# EAGLE design OPTOCAPE (EAGLE 6.6.0)
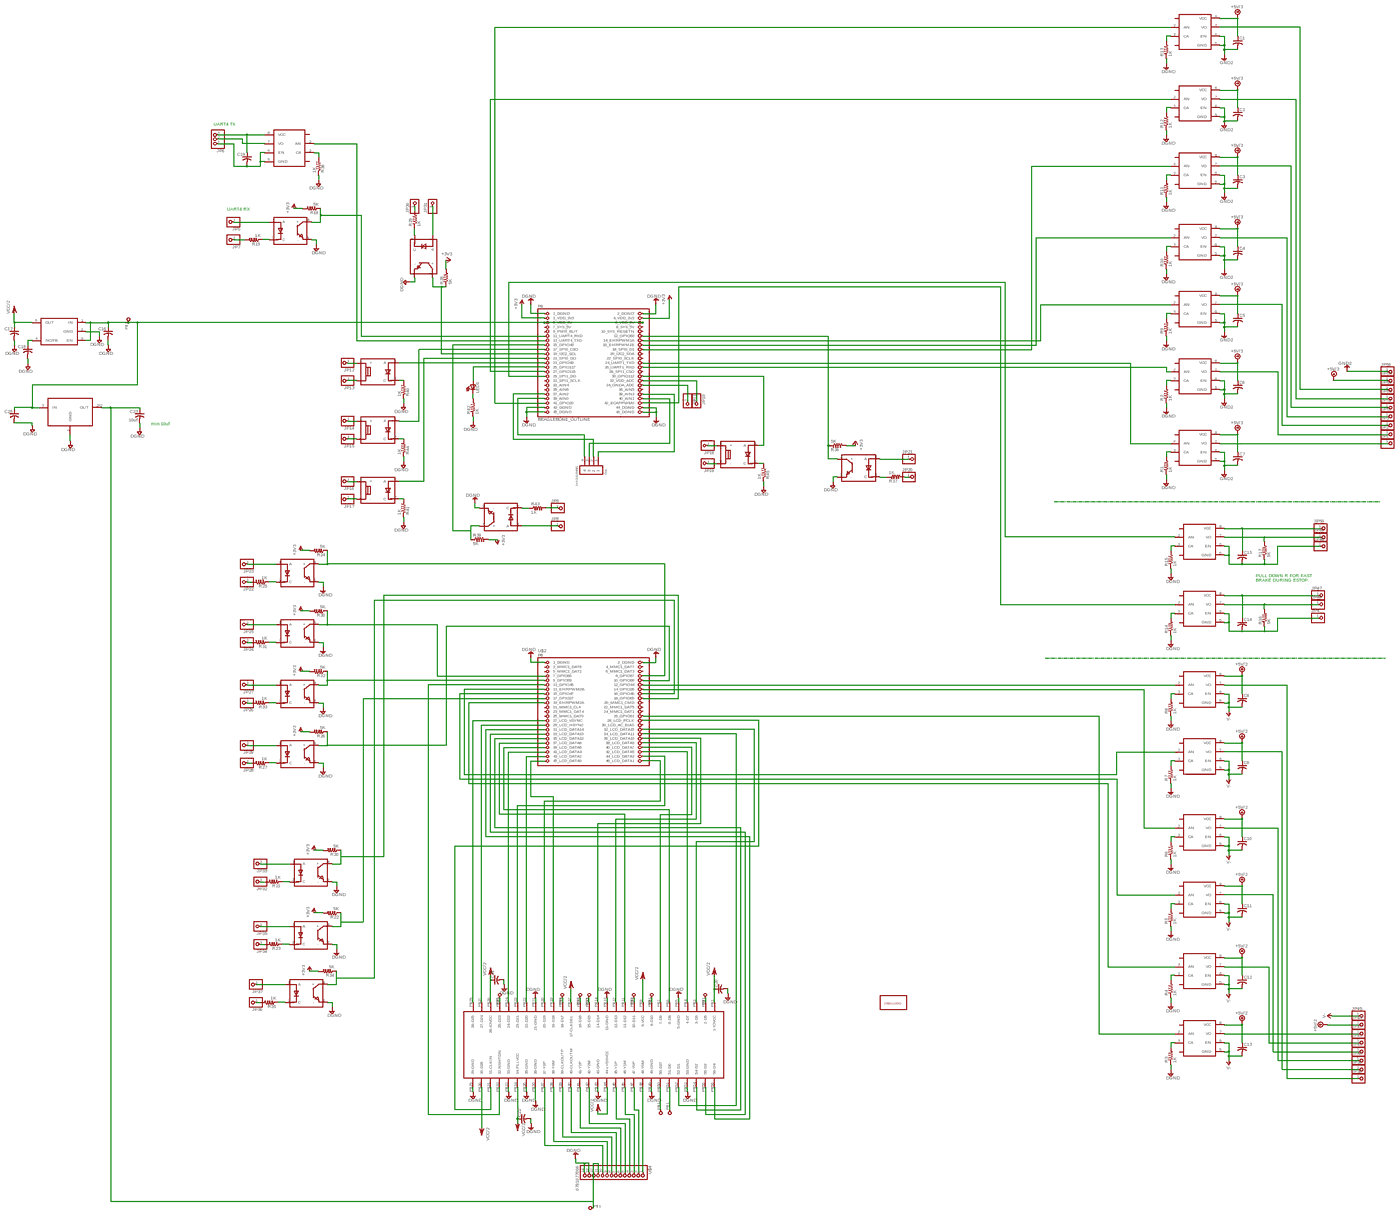
[diagram p0: schematic, sheet 1, overview]
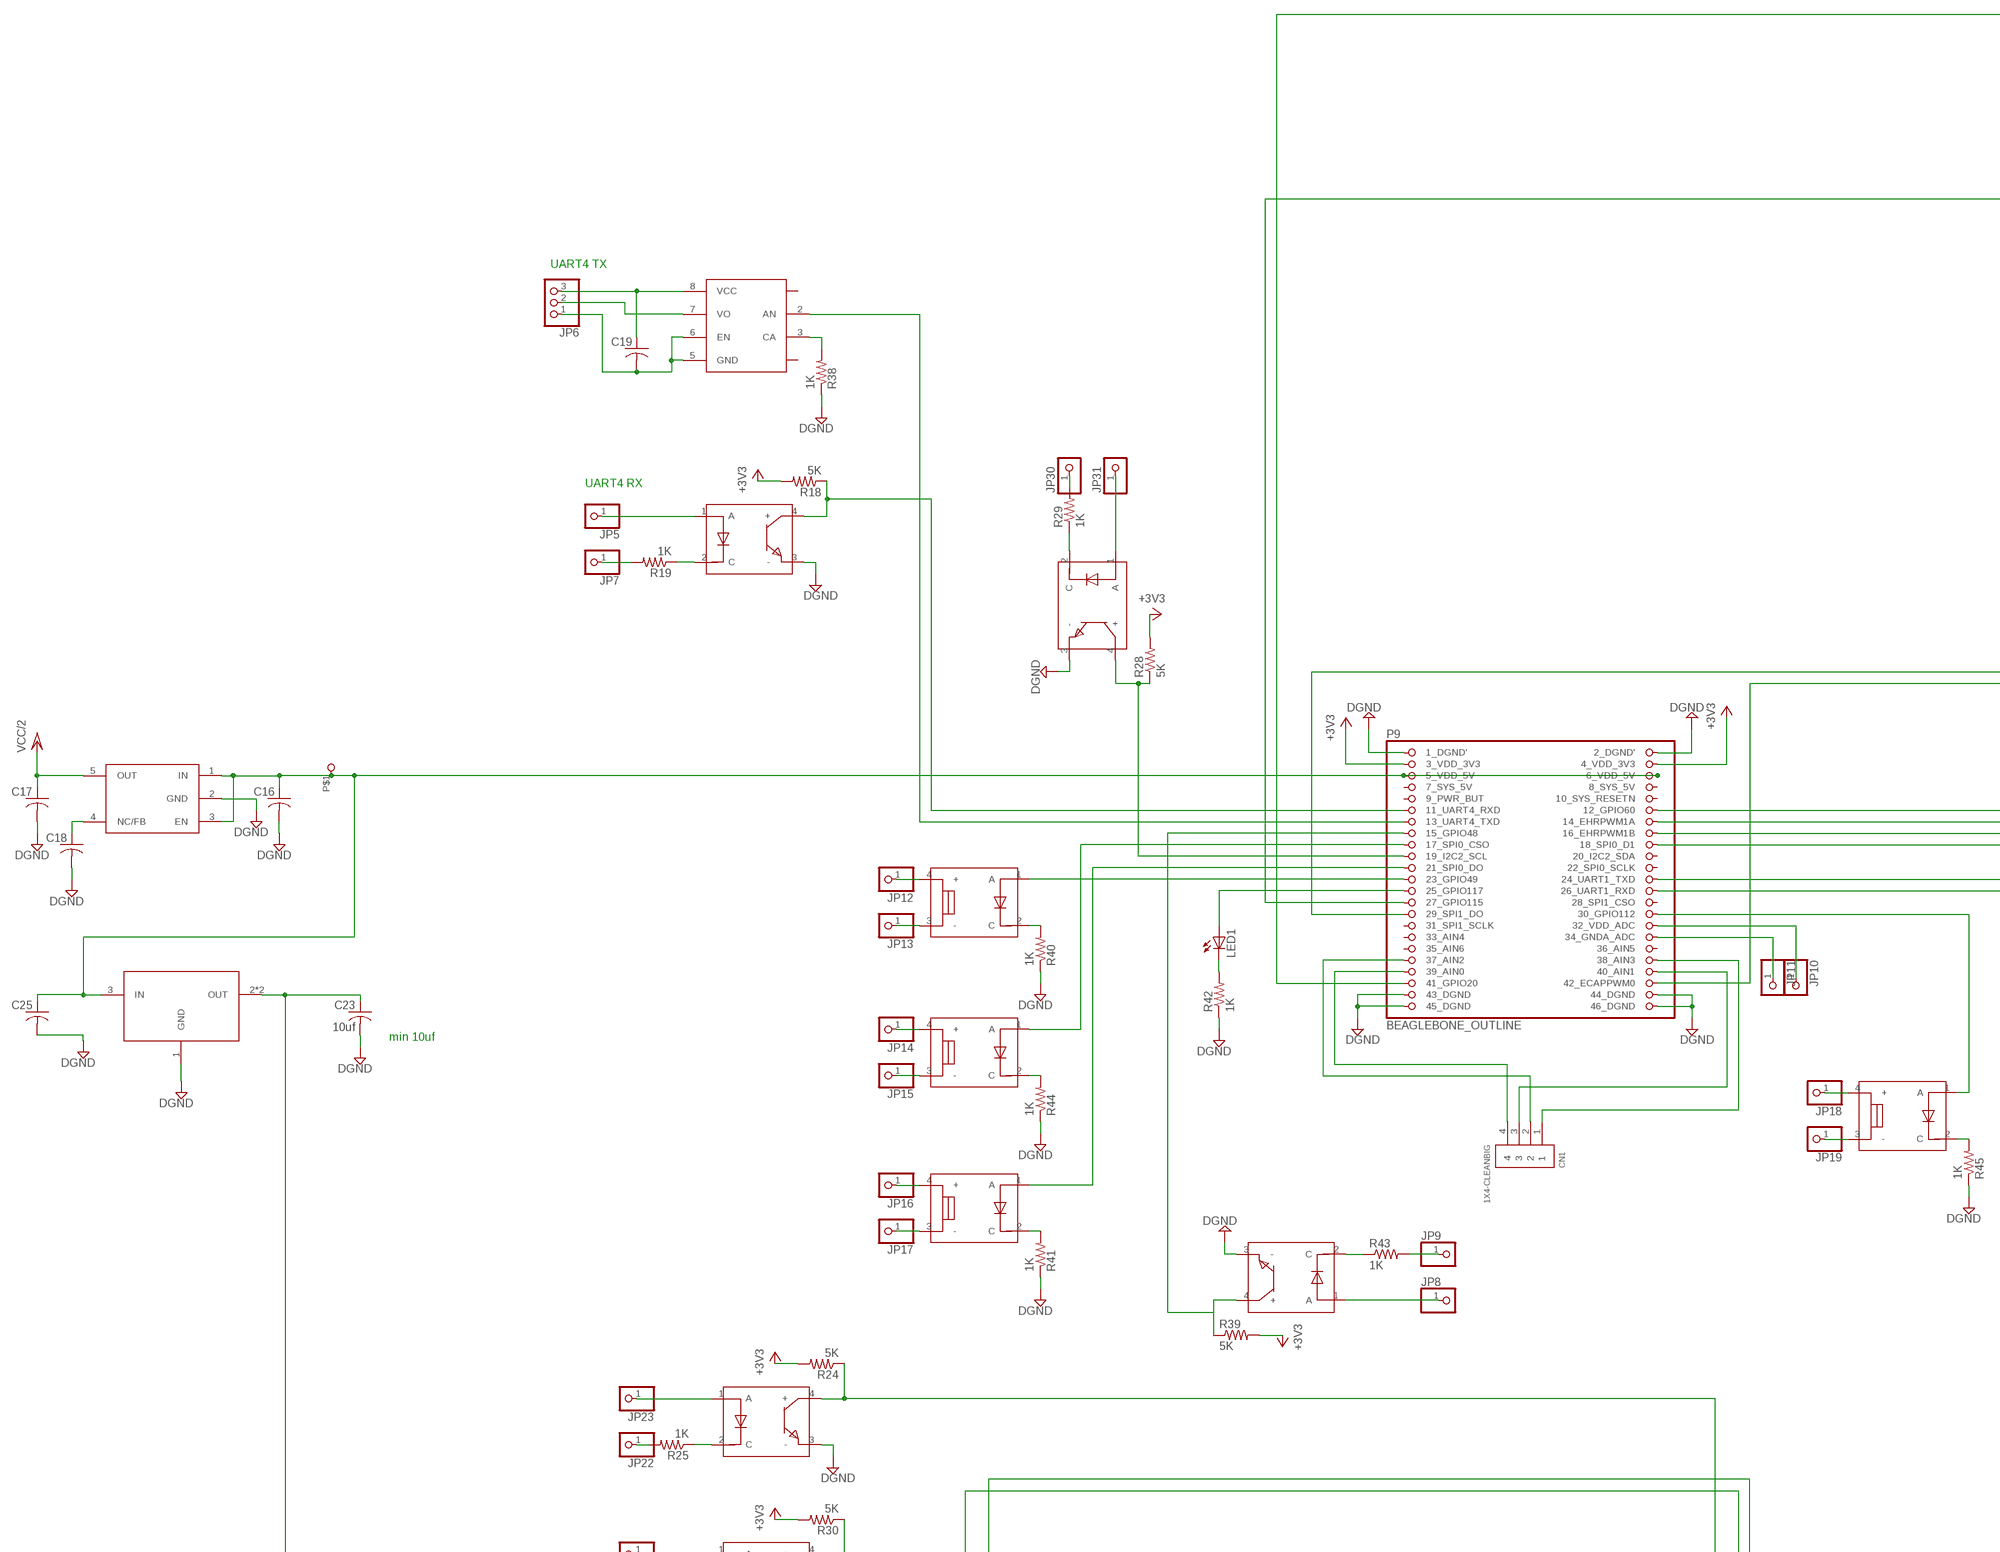
[diagram p1: schematic, sheet 1, part 1 of 4]
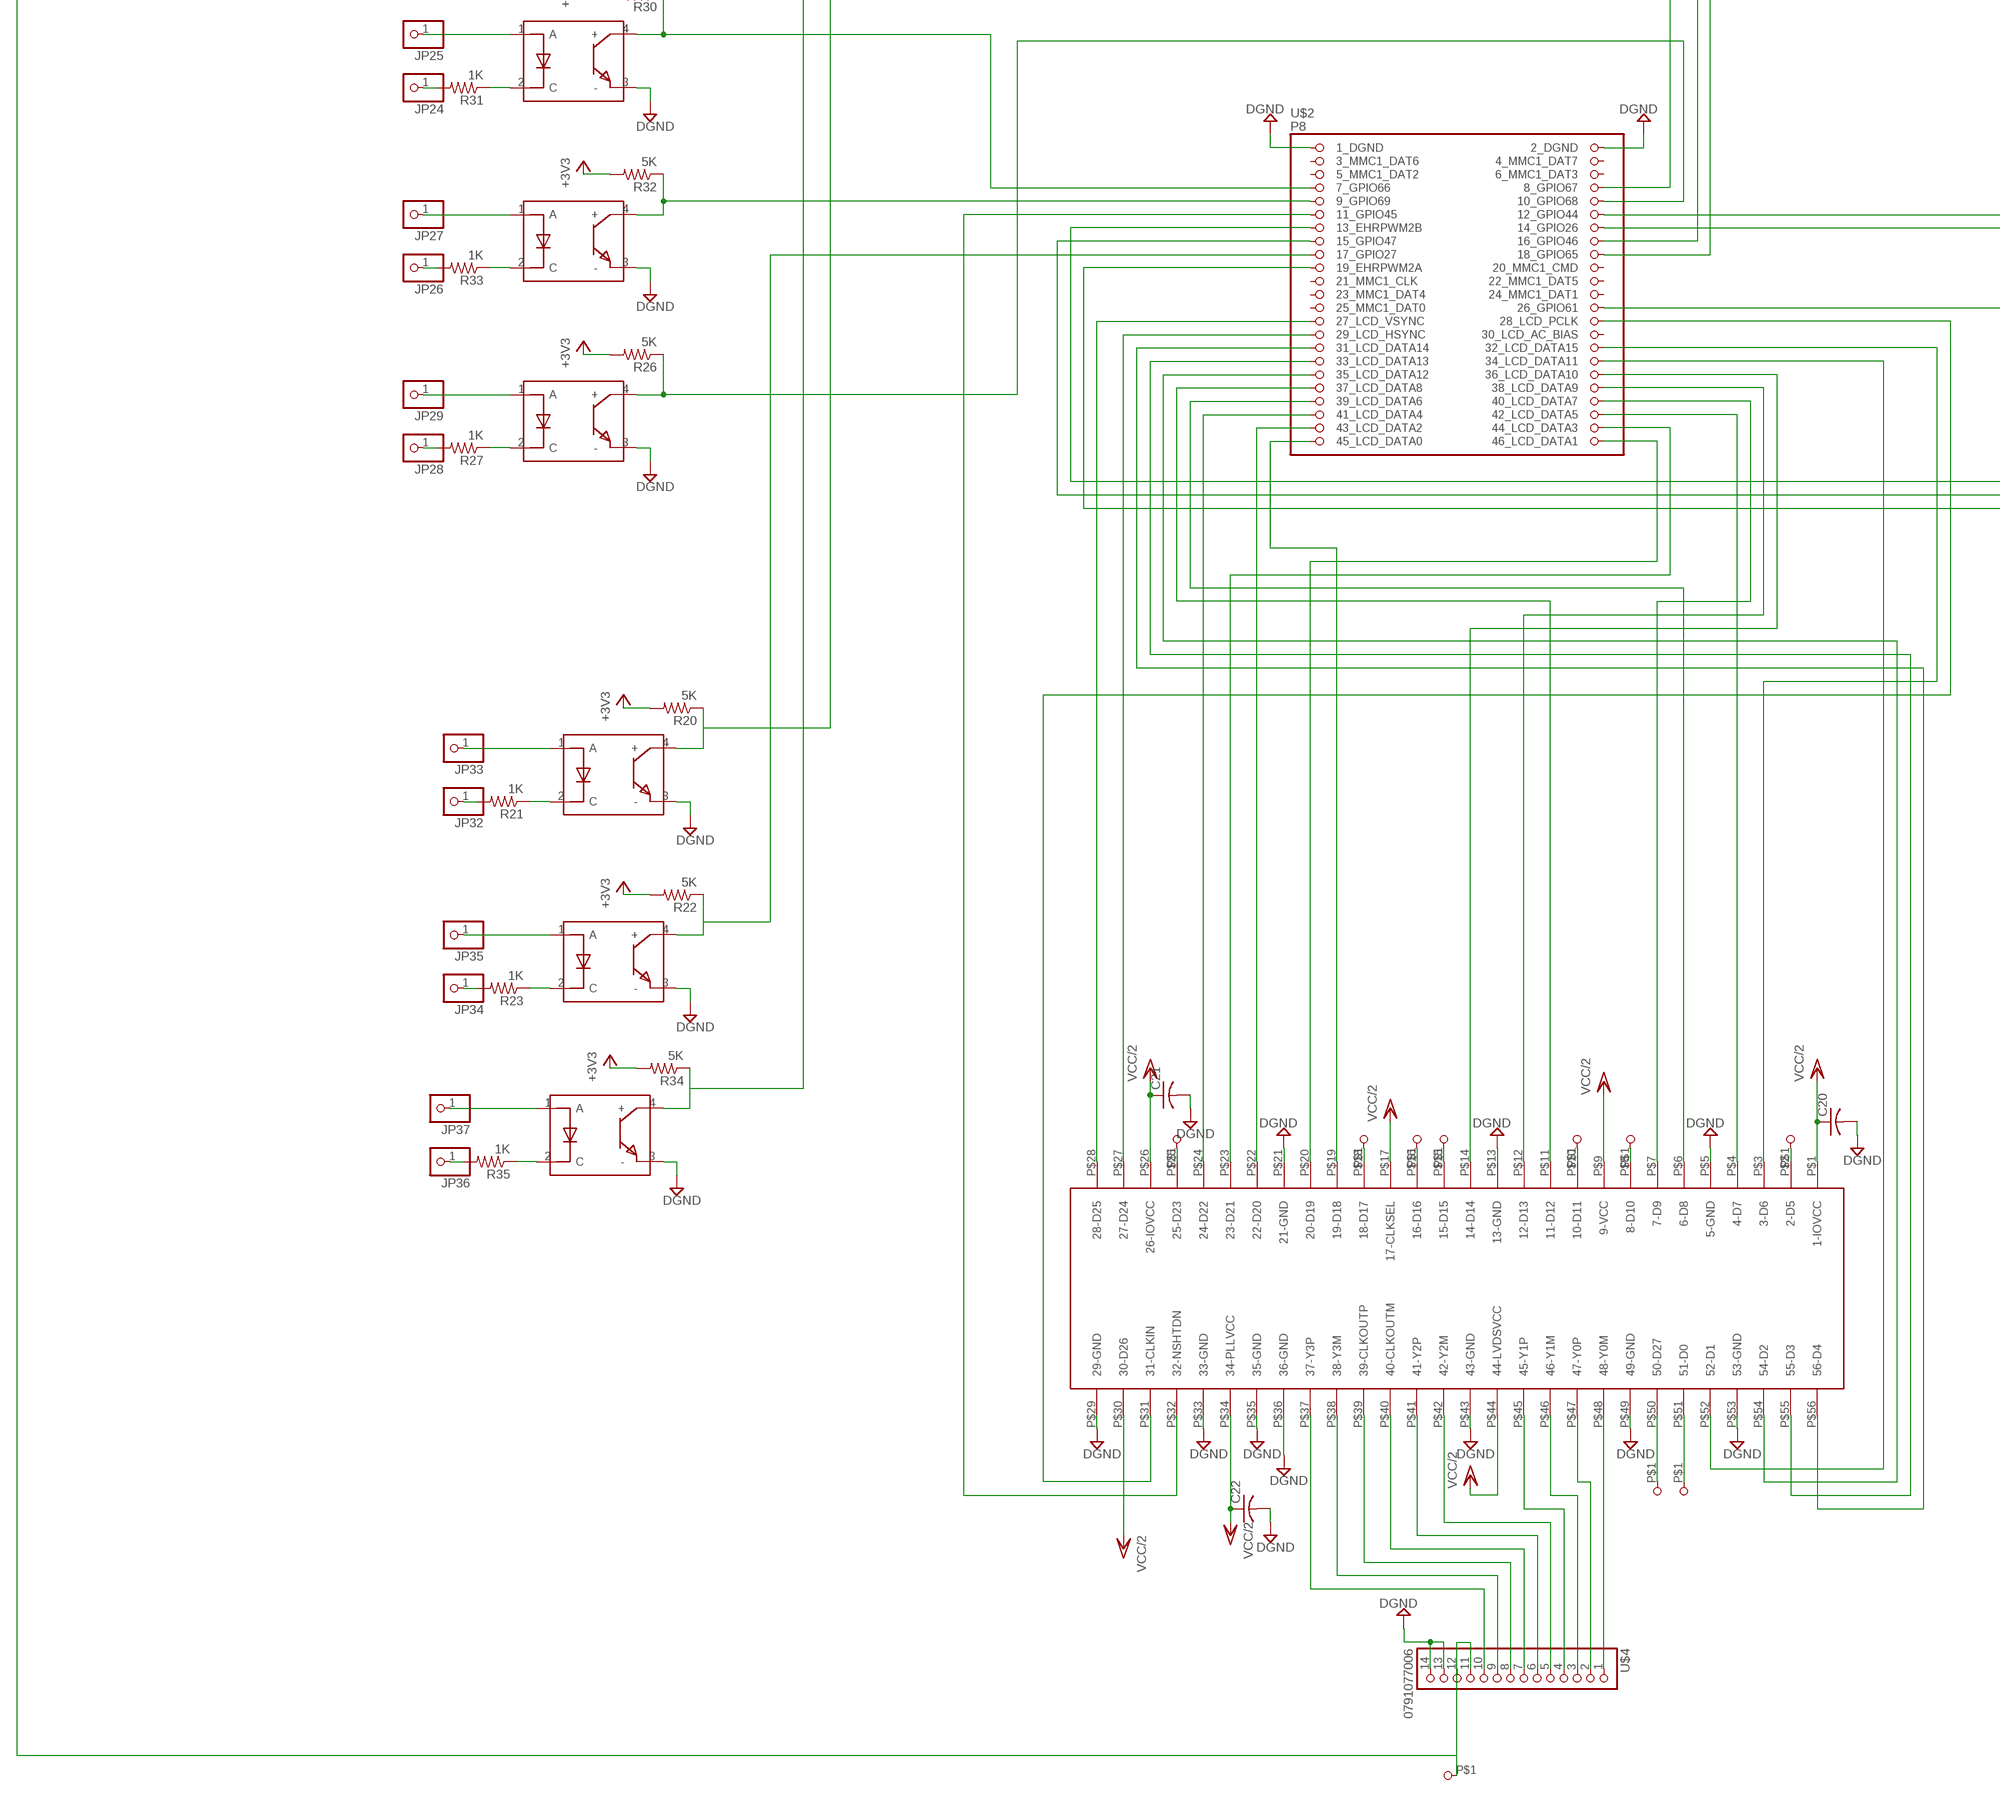
[diagram p2: schematic, sheet 1, part 2 of 4]
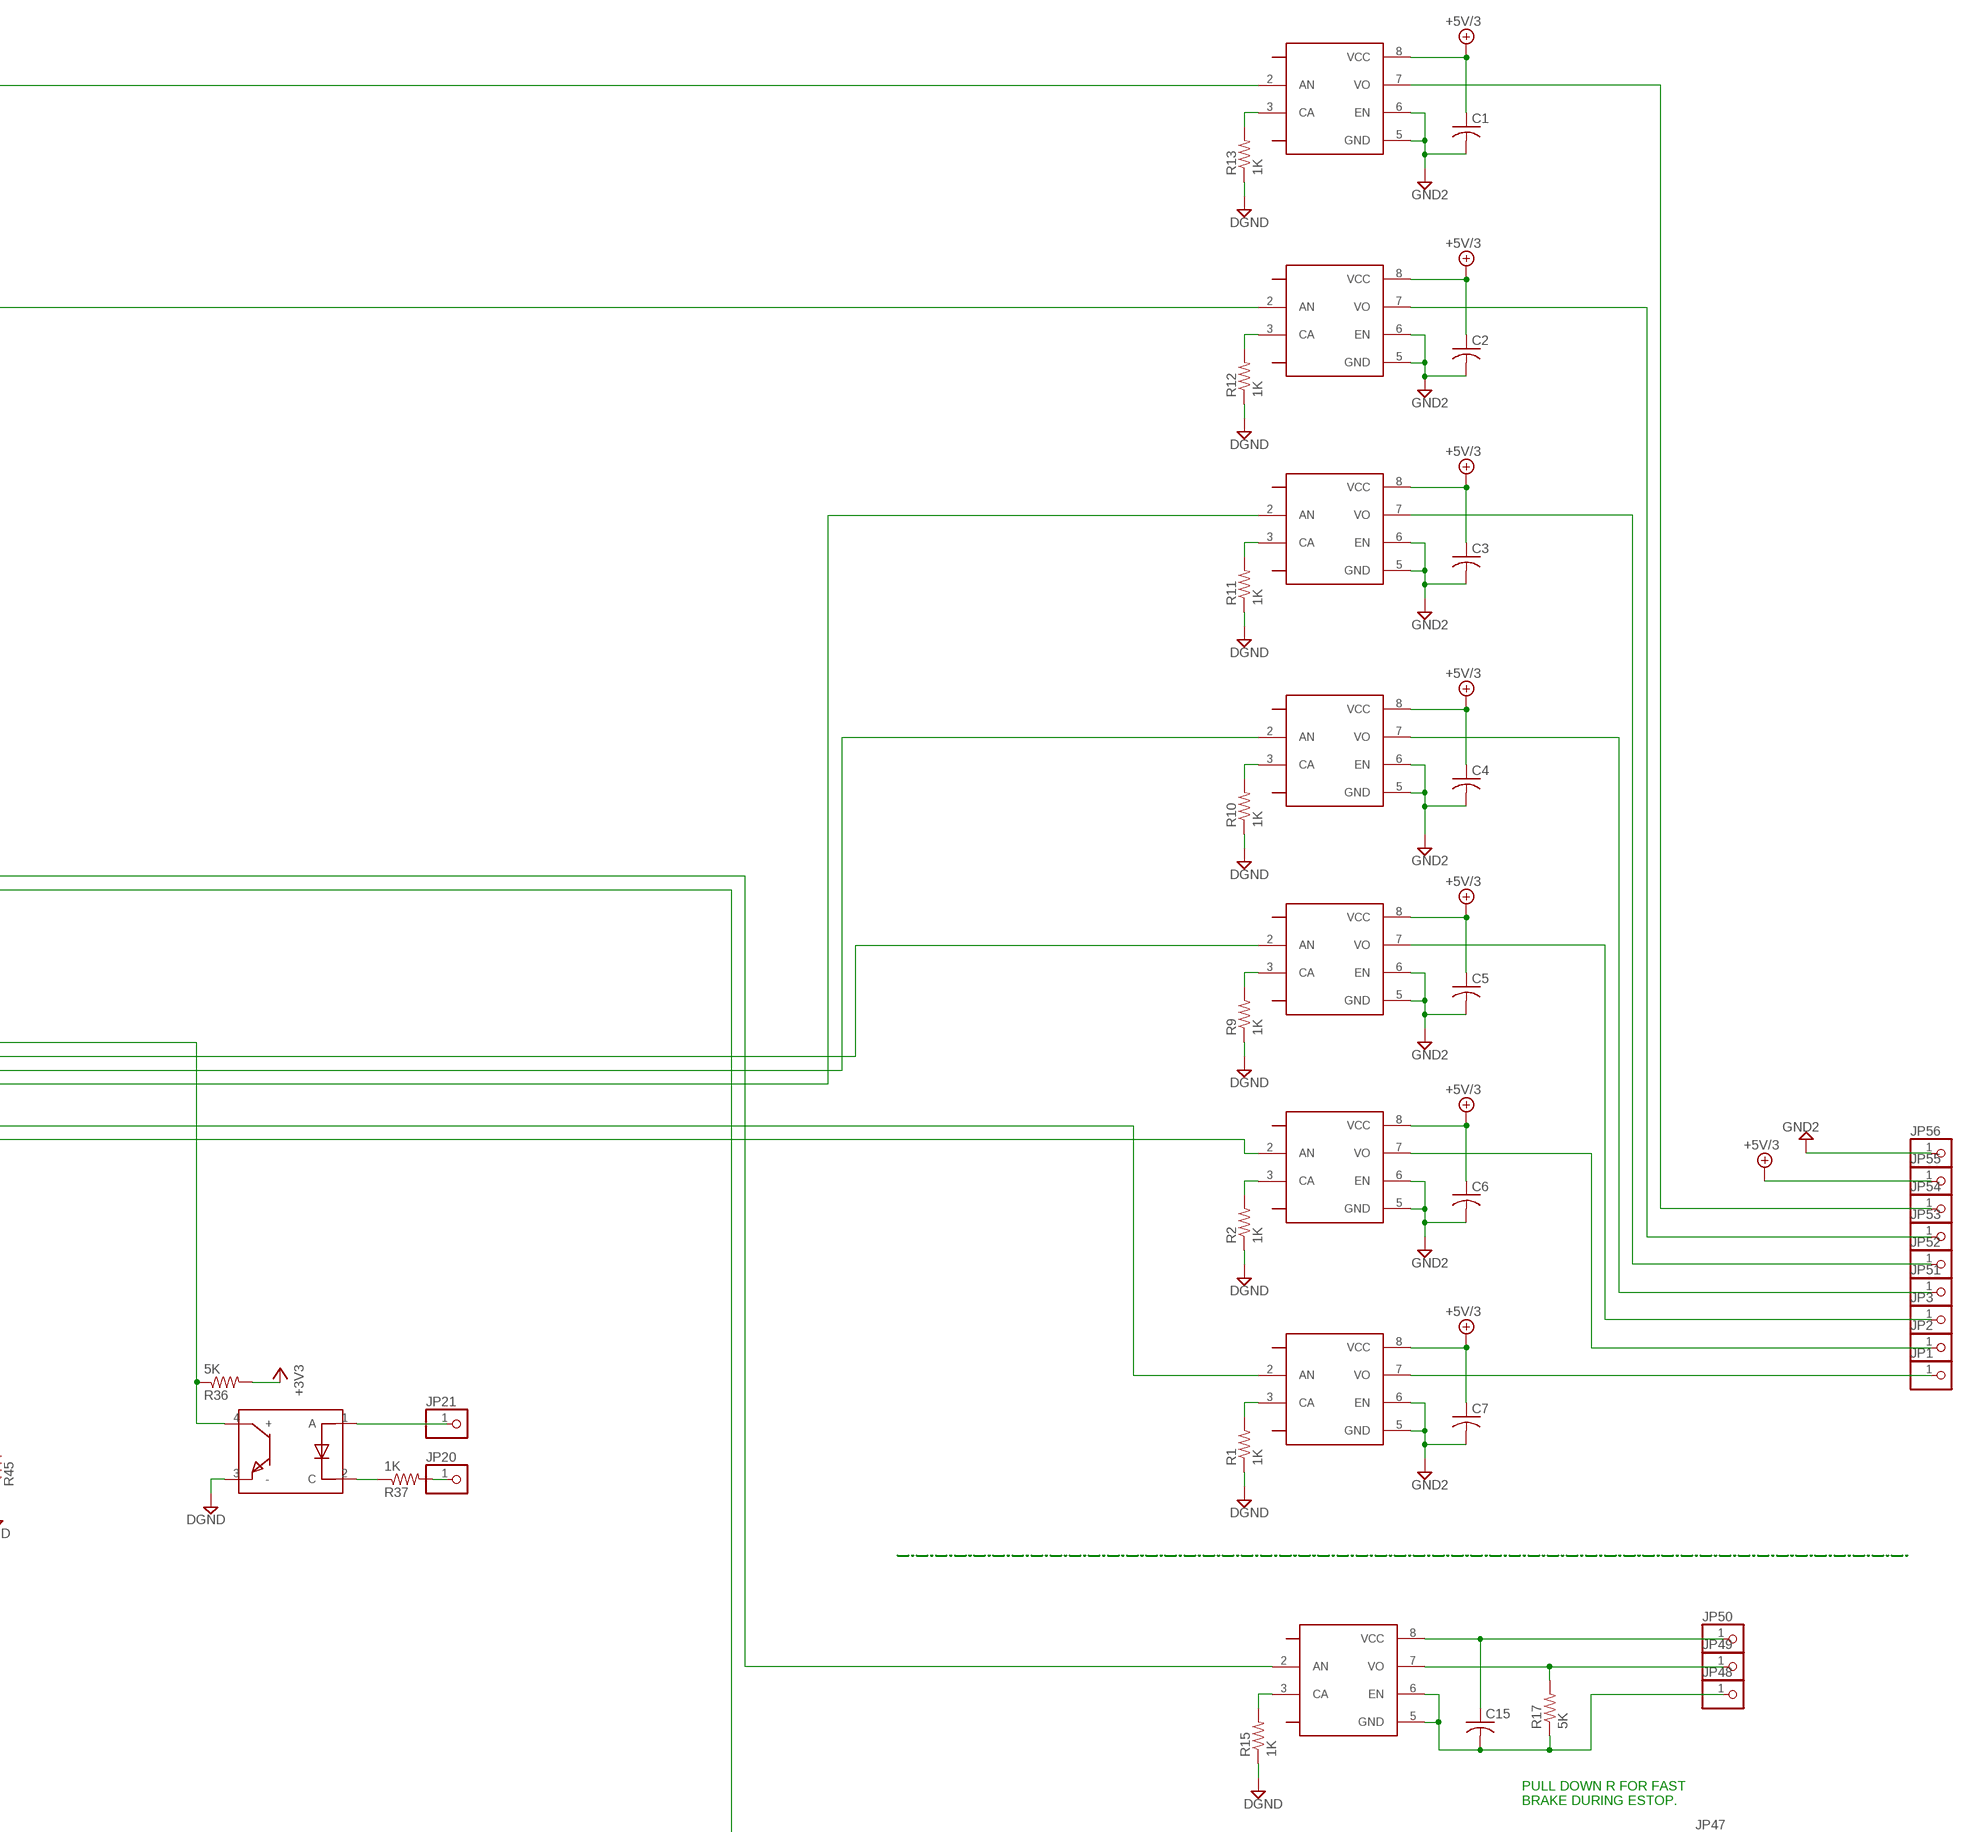
[diagram p3: schematic, sheet 1, part 3 of 4]
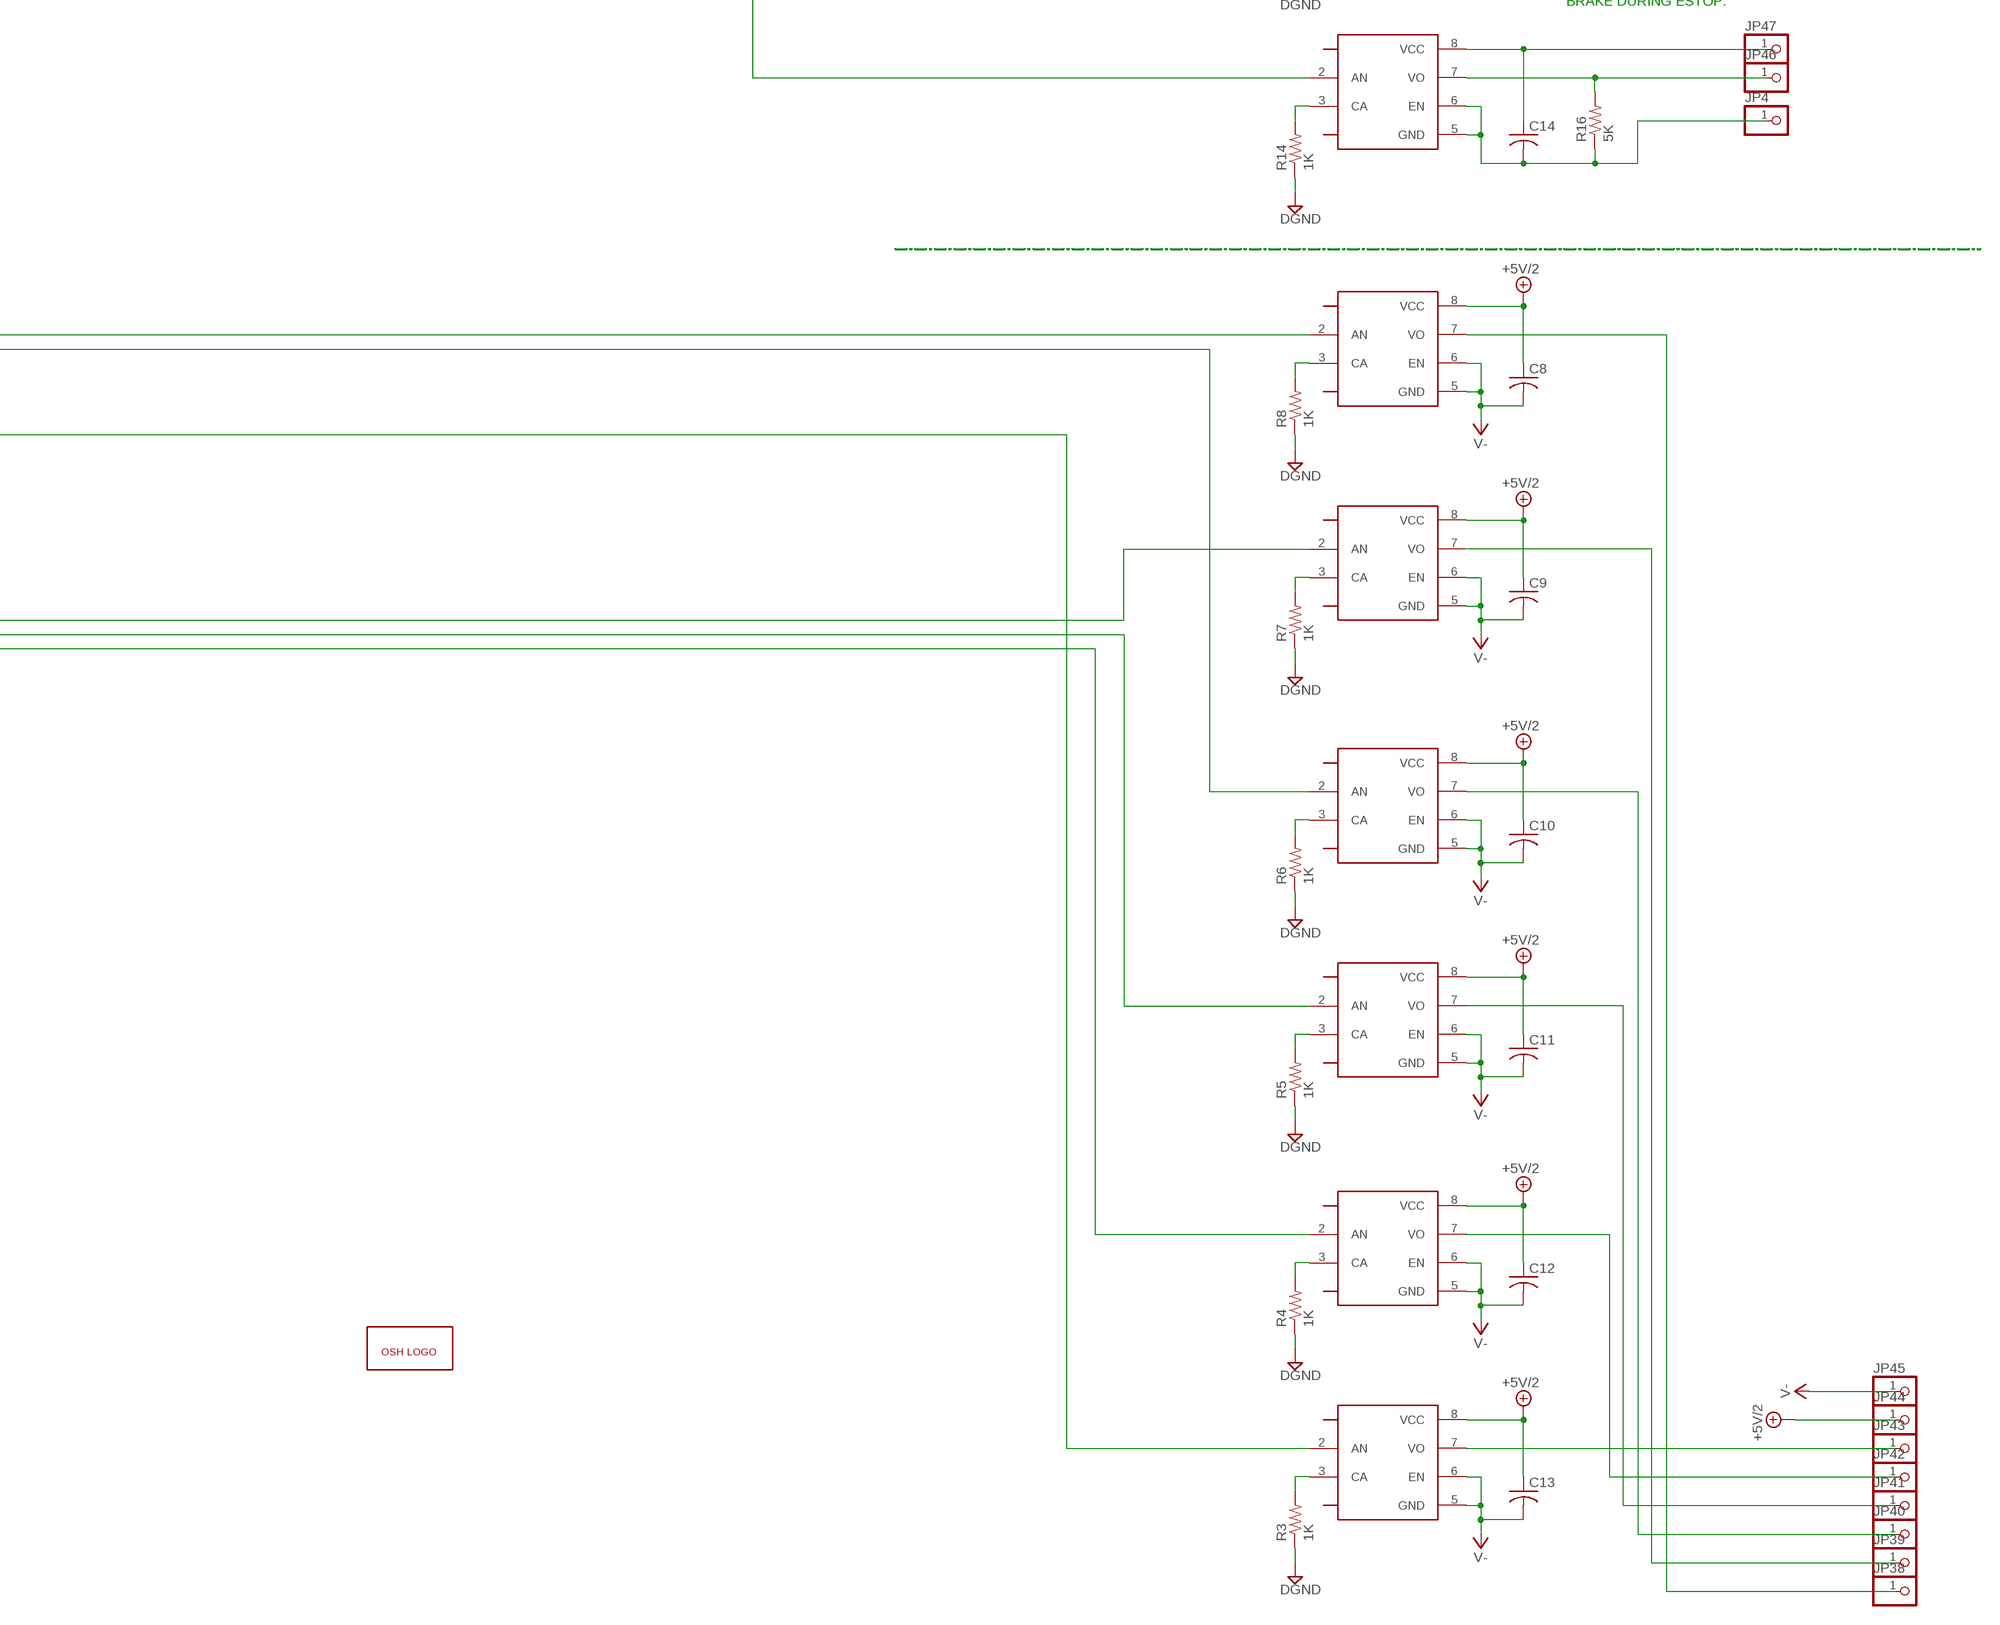
[diagram p4: schematic, sheet 1, part 4 of 4]

## Parts
0000  TLP2200F  [DIL08-ROUND]
8.12  TLP2200F  [DIL08-ROUND]
8.13  TLP2200F  [DIL08-ROUND]
8.14  TLP2200F  [DIL08-ROUND]
8.15  TLP2200F  [DIL08-ROUND]
8.19  TLP2200F  [DIL08-ROUND]
8.26  TLP2200F  [DIL08-ROUND]
9.3  TLP2200F  [DIL08-ROUND]
9.14  TLP2200F  [DIL08-ROUND]
9.16  TLP2200F  [DIL08-ROUND]
9.18  TLP2200F  [DIL08-ROUND]
9.24  TLP2200F  [DIL08-ROUND]
9.26  TLP2200F  [DIL08-ROUND]
9.27  TLP2200F  [DIL08-ROUND]
9.41  TLP2200F  [DIL08-ROUND]
1111  TLP2200F  [DIL08-ROUND]
C1  C-USC0805K  [C0805K]
C2  C-USC0805K  [C0805K]
C3  C-USC0805K  [C0805K]
C4  C-USC0805K  [C0805K]
C5  C-USC0805K  [C0805K]
C6  C-USC0805K  [C0805K]
C7  C-USC0805K  [C0805K]
C8  C-USC0805K  [C0805K]
C9  C-USC0805K  [C0805K]
C10  C-USC0805K  [C0805K]
C11  C-USC0805K  [C0805K]
C12  C-USC0805K  [C0805K]
C13  C-USC0805K  [C0805K]
C14  C-USC0805K  [C0805K]
C15  C-USC0805K  [C0805K]
C16  C-USC0805K  [C0805K]
C17  C-USC0805K  [C0805K]
C18  C-USC0402  [C0402]
C19  C-USC0805K  [C0805K]
C20  C-USC0402  [C0402]
C21  C-USC0402  [C0402]
C22  C-USC0402  [C0402]
C23  10uf  C-USC0805K  [C0805K]
C25  C-USC0402  [C0402]
CN1  1X4-CLEANBIG  [1X04-CLEANBIG]
JP1  PINHD-1X1CB  [1X01-CLEANBIG]
JP2  PINHD-1X1CB  [1X01-CLEANBIG]
JP3  PINHD-1X1CB  [1X01-CLEANBIG]
JP4  PINHD-1X1CB  [1X01-CLEANBIG]
JP5  PINHD-1X1CB  [1X01-CLEANBIG]
JP6  PINHD-1X3CB  [1X03-CLEANBIG]
JP7  PINHD-1X1CB  [1X01-CLEANBIG]
JP8  PINHD-1X1CB  [1X01-CLEANBIG]
JP9  PINHD-1X1CB  [1X01-CLEANBIG]
JP10  PINHD-1X1CB  [1X01-CLEANBIG]
JP11  PINHD-1X1CB  [1X01-CLEANBIG]
JP12  PINHD-1X1CB  [1X01-CLEANBIG]
JP13  PINHD-1X1CB  [1X01-CLEANBIG]
JP14  PINHD-1X1CB  [1X01-CLEANBIG]
JP15  PINHD-1X1CB  [1X01-CLEANBIG]
JP16  PINHD-1X1CB  [1X01-CLEANBIG]
JP17  PINHD-1X1CB  [1X01-CLEANBIG]
JP18  PINHD-1X1CB  [1X01-CLEANBIG]
JP19  PINHD-1X1CB  [1X01-CLEANBIG]
JP20  PINHD-1X1CB  [1X01-CLEANBIG]
JP21  PINHD-1X1CB  [1X01-CLEANBIG]
JP22  PINHD-1X1CB  [1X01-CLEANBIG]
JP23  PINHD-1X1CB  [1X01-CLEANBIG]
JP24  PINHD-1X1CB  [1X01-CLEANBIG]
JP25  PINHD-1X1CB  [1X01-CLEANBIG]
JP26  PINHD-1X1CB  [1X01-CLEANBIG]
JP27  PINHD-1X1CB  [1X01-CLEANBIG]
JP28  PINHD-1X1CB  [1X01-CLEANBIG]
JP29  PINHD-1X1CB  [1X01-CLEANBIG]
JP30  PINHD-1X1CB  [1X01-CLEANBIG]
JP31  PINHD-1X1CB  [1X01-CLEANBIG]
JP32  PINHD-1X1CB  [1X01-CLEANBIG]
JP33  PINHD-1X1CB  [1X01-CLEANBIG]
JP34  PINHD-1X1CB  [1X01-CLEANBIG]
JP35  PINHD-1X1CB  [1X01-CLEANBIG]
JP36  PINHD-1X1CB  [1X01-CLEANBIG]
JP37  PINHD-1X1CB  [1X01-CLEANBIG]
JP38  PINHD-1X1CB  [1X01-CLEANBIG]
JP39  PINHD-1X1CB  [1X01-CLEANBIG]
JP40  PINHD-1X1CB  [1X01-CLEANBIG]
JP41  PINHD-1X1CB  [1X01-CLEANBIG]
JP42  PINHD-1X1CB  [1X01-CLEANBIG]
JP43  PINHD-1X1CB  [1X01-CLEANBIG]
JP44  PINHD-1X1CB  [1X01-CLEANBIG]
JP45  PINHD-1X1CB  [1X01-CLEANBIG]
JP46  PINHD-1X1CB  [1X01-CLEANBIG]
JP47  PINHD-1X1CB  [1X01-CLEANBIG]
JP48  PINHD-1X1CB  [1X01-CLEANBIG]
JP49  PINHD-1X1CB  [1X01-CLEANBIG]
JP50  PINHD-1X1CB  [1X01-CLEANBIG]
JP51  PINHD-1X1CB  [1X01-CLEANBIG]
JP52  PINHD-1X1CB  [1X01-CLEANBIG]
JP53  PINHD-1X1CB  [1X01-CLEANBIG]
JP54  PINHD-1X1CB  [1X01-CLEANBIG]
JP55  PINHD-1X1CB  [1X01-CLEANBIG]
JP56  PINHD-1X1CB  [1X01-CLEANBIG]
LED1  LED5MM  [LED5MM]
R1  1K  R-US_R0603  [R0603]
R2  1K  R-US_R0603  [R0603]
R3  1K  R-US_R0603  [R0603]
R4  1K  R-US_R0603  [R0603]
R5  1K  R-US_R0603  [R0603]
R6  1K  R-US_R0603  [R0603]
R7  1K  R-US_R0603  [R0603]
R8  1K  R-US_R0603  [R0603]
R9  1K  R-US_R0603  [R0603]
R10  1K  R-US_R0603  [R0603]
R11  1K  R-US_R0603  [R0603]
R12  1K  R-US_R0603  [R0603]
R13  1K  R-US_R0603  [R0603]
R14  1K  R-US_R0603  [R0603]
R15  1K  R-US_R0603  [R0603]
R16  5K  R-US_R0603  [R0603]
R17  5K  R-US_R0603  [R0603]
R18  5K  R-US_R0603  [R0603]
R19  1K  R-US_R0603  [R0603]
R20  5K  R-US_R0603  [R0603]
R21  1K  R-US_R0603  [R0603]
R22  5K  R-US_R0603  [R0603]
R23  1K  R-US_R0603  [R0603]
R24  5K  R-US_R0603  [R0603]
R25  1K  R-US_R0603  [R0603]
R26  5K  R-US_R0603  [R0603]
R27  1K  R-US_R0603  [R0603]
R28  5K  R-US_R0603  [R0603]
R29  1K  R-US_R0603  [R0603]
R30  5K  R-US_R0603  [R0603]
R31  1K  R-US_R0603  [R0603]
R32  5K  R-US_R0603  [R0603]
R33  1K  R-US_R0603  [R0603]
R34  5K  R-US_R0603  [R0603]
R35  1K  R-US_R0603  [R0603]
R36  5K  R-US_R0603  [R0603]
R37  1K  R-US_R0603  [R0603]
R38  1K  R-US_R0603  [R0603]
R39  5K  R-US_R0603  [R0603]
R40  1K  R-US_R0603  [R0603]
R41  1K  R-US_R0603  [R0603]
R42  1K  R-US_R0603  [R0603]
R43  1K  R-US_R0603  [R0603]
R44  1K  R-US_R0603  [R0603]
R45  1K  R-US_R0603  [R0603]
SPICS1  TLP222A  [DIL04-ROUND]
SPICS2  TLP222A  [DIL04-ROUND]
SPICS3  TLP222A  [DIL04-ROUND]
SPICS4  TLP222A  [DIL04-ROUND]
TPS73133  TPS76350DBVR  [SOT23-5L]
U$1  FOD817B  [DIL04-ROUND]
U$2  BEAGLEBONE_OUTLINE  [BEAGLEBONE_SHIELD]
U$3  SN75LVDS83B  [DGG0056A]
U$4  0791077006  [0791077006]
U$5  DEAN_SMALL_VIA  [DEAN_SMALL_VIA]
U$6  FOD817B  [DIL04-ROUND]
U$7  FOD817B  [DIL04-ROUND]
U$8  FOD817B  [DIL04-ROUND]
U$9  FOD817B  [DIL04-ROUND]
U$10  FOD817B  [DIL04-ROUND]
U$11  FOD817B  [DIL04-ROUND]
U$12  FOD817B  [DIL04-ROUND]
U$13  FOD817B  [DIL04-ROUND]
U$14  FOD817B  [DIL04-ROUND]
U$15  FOD817B  [DIL04-ROUND]
U$16  DEAN_SMALL_VIA  [DEAN_SMALL_VIA]
U$17  OSH_LOGO  [OSH_LOGO]
U$18  LM1117  [SOT223]
U$19  DEAN_SMALL_VIA  [DEAN_SMALL_VIA]
U$20  DEAN_SMALL_VIA  [DEAN_SMALL_VIA]
U$21  DEAN_SMALL_VIA  [DEAN_SMALL_VIA]
U$22  DEAN_SMALL_VIA  [DEAN_SMALL_VIA]
U$23  DEAN_SMALL_VIA  [DEAN_SMALL_VIA]
U$24  DEAN_SMALL_VIA  [DEAN_SMALL_VIA]
U$25  DEAN_SMALL_VIA  [DEAN_SMALL_VIA]
U$32  DEAN_SMALL_VIA  [DEAN_SMALL_VIA]
U$33  DEAN_SMALL_VIA  [DEAN_SMALL_VIA]

## Nets
8.7: R30.1 U$2.7(7_GPIO66) U$12.4(+)
8.8: R24.1 U$2.8(8_GPIO67) U$9.4(+)
8.9: R32.1 U$2.9(9_GPIO69) U$13.4(+)
8.10: R26.1 U$2.10(10_GPIO68) U$10.4(+)
8.11: U$2.11(11_GPIO45) U$3.P$32(32-NSHTDN)
8.12: 8.12.2(AN) U$2.12(12_GPIO44)
8.13: 8.13.2(AN) U$2.13(13_EHRPWM2B)
8.14: 8.14.2(AN) U$2.14(14_GPIO26)
8.15: 8.15.2(AN) U$2.15(15_GPIO47)
8.16: R34.1 U$2.16(16_GPIO46) U$14.4(+)
8.17: R22.1 U$2.17(17_GPIO27) U$8.4(+)
8.18: R20.1 U$2.18(18_GPIO65) U$7.4(+)
8.19: 8.19.2(AN) U$2.19(19_EHRPWM2A)
8.26: 8.26.2(AN) U$2.26(26_GPIO61)
9.11: R18.1 U$2.57(11_UART4_RXD) U$6.4(+)
9.12: R36.1 U$2.58(12_GPIO60) U$15.4(+)
9.13: 9.3.2(AN) U$2.59(13_UART4_TXD)
9.14: 9.14.2(AN) U$2.60(14_EHRPWM1A)
9.15: R39.1 U$1.4(+) U$2.61(15_GPIO48)
9.16: 9.16.2(AN) U$2.62(16_EHRPWM1B)
9.17: SPICS3.1(A) U$2.63(17_SPI0_CSO)
9.18: 9.18.2(AN) U$2.64(18_SPI0_D1)
9.19: R28.1 U$2.65(19_I2C2_SCL) U$11.4(+)
9.21: SPICS2.1(A) U$2.67(21_SPI0_DO)
9.23: SPICS1.1(A) U$2.69(23_GPIO49)
9.24: 9.24.2(AN) U$2.70(24_UART1_TXD)
9.25: LED1.A U$2.71(25_GPIO117)
9.26: 9.26.2(AN) U$2.72(26_UART1_RXD)
9.27: 9.27.2(AN) U$2.73(27_GPIO115)
9.29: 1111.2(AN) U$2.75(29_SPI1_DO)
9.30: SPICS4.1(A) U$2.76(30_GPIO112)
9.32: JP10.1 U$2.78(32_VDD_ADC)
9.34: JP11.1 U$2.80(34_GNDA_ADC)
9.37: CN1.2 U$2.83(37_AIN2)
9.38: CN1.1 U$2.84(38_AIN3)
9.39: CN1.4 U$2.85(39_AIN0)
9.40: CN1.3 U$2.86(40_AIN1)
9.41: 9.41.2(AN) U$2.87(41_GPIO20)
9.42: 0000.2(AN) U$2.88(42_ECAPPWM0)
+3V3: R18.2 R20.2 R22.2 R24.2 R26.2 R28.2 R30.2 R32.2 R34.2 R36.2 R39.2 U$2.49(3_VDD_3V3) U$2.50(4_VDD_3V3)
+5V/2: 8.12.8(VCC) 8.13.8(VCC) 8.14.8(VCC) 8.15.8(VCC) 8.19.8(VCC) 8.26.8(VCC) C8.1 C9.1 C10.1 C11.1 C12.1 C13.1 JP44.1
DGND: C16.2 C17.2 C18.2 C20.2 C21.2 C22.2 C23.2 C25.2 R1.1 R2.1 R3.1 R4.1 R5.1 R6.1 R7.1 R8.1 R9.1 R10.1 R11.1 R12.1 R13.1 R14.1 R15.1 R38.1 R40.1 R41.1 R42.1 R44.1 R45.1 TPS73133.2(GND) U$1.3(-) U$2.1(1_DGND) U$2.2(2_DGND) U$2.47(1_DGND') U$2.48(2_DGND') U$2.89(43_DGND) U$2.90(44_DGND) U$2.91(45_DGND) U$2.92(46_DGND) U$3.P$5(5-GND) U$3.P$13(13-GND) U$3.P$21(21-GND) U$3.P$29(29-GND) U$3.P$33(33-GND) U$3.P$35(35-GND) U$3.P$36(36-GND) U$3.P$43(43-GND) U$3.P$49(49-GND) U$3.P$53(53-GND) U$4.13 U$4.14 U$6.3(-) U$7.3(-) U$8.3(-) U$9.3(-) U$10.3(-) U$11.3(-) U$12.3(-) U$13.3(-) U$14.3(-) U$15.3(-) U$18.1(GND)
GND2: 9.14.5(GND) 9.14.6(EN) 9.16.5(GND) 9.16.6(EN) 9.18.5(GND) 9.18.6(EN) 9.24.5(GND) 9.24.6(EN) 9.26.5(GND) 9.26.6(EN) 9.27.5(GND) 9.27.6(EN) 9.41.5(GND) 9.41.6(EN) C1.2 C2.2 C3.2 C4.2 C5.2 C6.2 C7.2 JP56.1
HSYNC: U$2.29(29_LCD_HSYNC) U$3.P$27(27-D24)
N$1: 9.24.3(CA) R1.2
N$2: C23.1 U$4.11 U$4.12 U$5.P$1 U$18.2(OUT) U$18.TAB(OUT)
N$4: 9.26.3(CA) R2.2
N$6: 8.26.3(CA) R3.2
N$8: 8.19.3(CA) R4.2
N$10: 8.15.3(CA) R5.2
N$12: 8.14.3(CA) R6.2
N$14: 8.13.3(CA) R7.2
N$16: 8.12.3(CA) R8.2
N$17: 9.26.7(VO) JP2.1
N$18: 9.14.3(CA) R9.2
N$19: 9.24.7(VO) JP1.1
N$20: 9.16.3(CA) R10.2
N$22: 9.18.3(CA) R11.2
N$23: C18.1 TPS73133.4(NC/FB)
N$24: 9.27.3(CA) R12.2
N$26: 9.41.3(CA) R13.2
N$31: 0000.3(CA) R14.2
N$32: 1111.3(CA) R15.2
N$33: 0000.5(GND) 0000.6(EN) C14.2 JP4.1 R16.1
N$34: 1111.5(GND) 1111.6(EN) C15.2 JP48.1 R17.1
N$35: 9.14.7(VO) JP3.1
N$36: 9.16.7(VO) JP51.1
N$37: 9.18.7(VO) JP52.1
N$38: 9.27.7(VO) JP53.1
N$39: 9.41.7(VO) JP54.1
N$45: 0000.8(VCC) C14.1 JP47.1
N$46: 1111.8(VCC) C15.1 JP50.1
N$47: 1111.7(VO) JP49.1 R17.2
N$48: 0000.7(VO) JP46.1 R16.2
N$49: 8.12.7(VO) JP38.1
N$50: 8.13.7(VO) JP39.1
N$51: 8.14.7(VO) JP40.1
N$52: 8.15.7(VO) JP41.1
N$53: 8.19.7(VO) JP42.1
N$54: 8.26.7(VO) JP43.1
N$55: U$2.45(45_LCD_DATA0) U$3.P$19(19-D18)
N$56: U$2.46(46_LCD_DATA1) U$3.P$20(20-D19)
N$57: U$2.43(43_LCD_DATA2) U$3.P$22(22-D20)
N$58: U$2.44(44_LCD_DATA3) U$3.P$23(23-D21)
N$59: U$2.41(41_LCD_DATA4) U$3.P$24(24-D22)
N$60: U$2.42(42_LCD_DATA5) U$3.P$4(4-D7)
N$63: U$2.39(39_LCD_DATA6) U$3.P$6(6-D8)
N$64: U$2.40(40_LCD_DATA7) U$3.P$7(7-D9)
N$65: U$2.37(37_LCD_DATA8) U$3.P$11(11-D12)
N$66: U$2.38(38_LCD_DATA9) U$3.P$12(12-D13)
N$67: U$2.36(36_LCD_DATA10) U$3.P$14(14-D14)
N$68: U$2.34(34_LCD_DATA11) U$3.P$52(52-D1)
N$69: U$2.35(35_LCD_DATA12) U$3.P$54(54-D2)
N$70: U$2.33(33_LCD_DATA13) U$3.P$55(55-D3)
N$71: U$2.31(31_LCD_DATA14) U$3.P$56(56-D4)
N$72: U$2.32(32_LCD_DATA15) U$3.P$3(3-D6)
N$73: U$3.P$2(2-D5) U$19.P$1
N$74: U$3.P$50(50-D27) U$20.P$1
N$75: U$3.P$8(8-D10) U$21.P$1
N$76: U$3.P$10(10-D11) U$22.P$1
N$77: U$3.P$16(16-D16) U$23.P$1
N$78: U$3.P$18(18-D17) U$24.P$1
N$79: U$3.P$25(25-D23) U$25.P$1
N$83: JP12.1 SPICS1.4(+)
N$84: U$3.P$48(48-Y0M) U$4.1
N$85: U$3.P$47(47-Y0P) U$4.2
N$86: U$3.P$46(46-Y1M) U$4.3
N$87: U$3.P$45(45-Y1P) U$4.4
N$88: U$3.P$42(42-Y2M) U$4.5
N$89: U$3.P$41(41-Y2P) U$4.6
N$90: U$3.P$40(40-CLKOUTM) U$4.7
N$91: U$3.P$39(39-CLKOUTP) U$4.8
N$92: U$3.P$38(38-Y3M) U$4.9
N$93: U$3.P$37(37-Y3P) U$4.10
N$94: JP21.1 U$15.1(A)
N$97: R19.1 U$6.2(C)
N$100: U$3.P$51(51-D0) U$32.P$1
N$101: U$3.P$15(15-D15) U$33.P$1
N$102: JP13.1 SPICS1.3(-)
N$103: JP14.1 SPICS3.4(+)
N$104: JP15.1 SPICS3.3(-)
N$105: C16.1 C25.1 TPS73133.1(IN) TPS73133.3(EN) U$2.51(5_VDD_5V) U$2.52(6_VDD_5V) U$16.P$1 U$18.3(IN)
N$106: R21.1 U$7.2(C)
N$108: R23.1 U$8.2(C)
N$110: R25.1 U$9.2(C)
N$111: R45.2 SPICS4.2(C)
N$112: R27.1 U$10.2(C)
N$114: R29.1 U$11.2(C)
N$116: R31.1 U$12.2(C)
N$117: JP16.1 SPICS2.4(+)
N$118: R33.1 U$13.2(C)
N$120: R35.1 U$14.2(C)
N$122: R37.1 U$15.2(C)
N$123: 9.3.3(CA) R38.2
N$125: R40.2 SPICS1.2(C)
N$126: R41.2 SPICS2.2(C)
N$127: LED1.K(C) R42.2
N$129: 9.3.7(VO) JP6.2
N$130: 9.3.5(GND) 9.3.6(EN) C19.2 JP6.1
N$132: JP5.1 U$6.1(A)
N$133: JP7.1 R19.2
N$134: R43.1 U$1.2(C)
N$135: JP8.1 U$1.1(A)
N$136: JP9.1 R43.2
N$137: 9.3.8(VCC) C19.1 JP6.3
N$139: R44.2 SPICS3.2(C)
N$142: JP17.1 SPICS2.3(-)
N$143: JP19.1 SPICS4.3(-)
N$144: JP18.1 SPICS4.4(+)
N$146: JP20.1 R37.2
N$147: JP36.1 R35.2
N$148: JP37.1 U$14.1(A)
N$149: JP34.1 R23.2
N$150: JP35.1 U$8.1(A)
N$151: JP32.1 R21.2
N$152: JP33.1 U$7.1(A)
N$153: JP30.1 R29.2
N$154: JP31.1 U$11.1(A)
N$155: JP28.1 R27.2
N$156: JP29.1 U$10.1(A)
N$157: JP26.1 R33.2
N$158: JP27.1 U$13.1(A)
N$159: JP24.1 R31.2
N$160: JP25.1 U$12.1(A)
N$161: JP22.1 R25.2
N$162: JP23.1 U$9.1(A)
PCLK: U$2.28(28_LCD_PCLK) U$3.P$31(31-CLKIN)
V-: 8.12.5(GND) 8.12.6(EN) 8.13.5(GND) 8.13.6(EN) 8.14.5(GND) 8.14.6(EN) 8.15.5(GND) 8.15.6(EN) 8.19.5(GND) 8.19.6(EN) 8.26.5(GND) 8.26.6(EN) C8.2 C9.2 C10.2 C11.2 C12.2 C13.2 JP45.1
VCC/2: C17.1 C20.1 C21.1 C22.1 TPS73133.5(OUT) U$3.P$1(1-IOVCC) U$3.P$9(9-VCC) U$3.P$17(17-CLKSEL) U$3.P$26(26-IOVCC) U$3.P$30(30-D26) U$3.P$34(34-PLLVCC) U$3.P$44(44-LVDSVCC)
VSYNC: U$2.27(27_LCD_VSYNC) U$3.P$28(28-D25)
XXXXXX: 9.14.8(VCC) 9.16.8(VCC) 9.18.8(VCC) 9.24.8(VCC) 9.26.8(VCC) 9.27.8(VCC) 9.41.8(VCC) C1.1 C2.1 C3.1 C4.1 C5.1 C6.1 C7.1 JP55.1 ; supply symbol labelled +5V/3
Unconnected: U$2.3(3_MMC1_DAT6) U$2.4(4_MMC1_DAT7) U$2.5(5_MMC1_DAT2) U$2.6(6_MMC1_DAT3) U$2.20(20_MMC1_CMD) U$2.21(21_MMC1_CLK) U$2.22(22_MMC1_DAT5) U$2.23(23_MMC1_DAT4) U$2.24(24_MMC1_DAT1) U$2.25(25_MMC1_DAT0) U$2.30(30_LCD_AC_BIAS) U$2.54(8_SYS_5V) U$2.55(9_PWR_BUT) U$2.56(10_SYS_RESETN) U$2.66(20_I2C2_SDA) U$2.68(22_SPI0_SCLK) U$2.74(28_SPI1_CSO) U$2.77(31_SPI1_SCLK) U$2.79(33_AIN4) U$2.81(35_AIN6) U$2.82(36_AIN5)

## Notes on the sheet
- UART4 TX
- UART4 RX
- min 10uf
- PULL DOWN R FOR FAST 
  BRAKE DURING ESTOP.

## Power pins joined to a net without a drawn wire
7_SYS_5V: U$2.53(7_SYS_5V)

## Library data of the parts
0000 8.12-8.15 8.19 8.26 9.3 9.14 9.16 9.18 9.24 9.26 9.27 9.41 1111 = Dean:TLP2200F
C1-C15 C19 = rcl:C-US: CAPACITOR, American symbol
C16-C18 C20-C23 C25 = Dean:C-US: CAPACITOR, American symbol
CN1 = Dean:1X4: 4-pin connector
JP1-JP5 JP7-JP56 = Dean:PINHD-1X1: Pin header 1x1 for 0.1" spacing With round pins
JP6 = Dean:PINHD-1X3: PIN HEADER
LED1 = Dean:LED: LED OSRAM: - CHIPLED LG R971, LG N971, LY N971, LG Q971, LY Q971, LO R971, LY R971 LH N974, LH R974 LS Q976, LO Q976, LY Q976 LO Q996 - Hyper CHIPLED LW Q18S LB Q993, LB Q99A, LB R99A - SideLED LS A670, LO A670, LY A670, LG A670, LP A670 LB A673, LV A673, LT A673, LW A673 LH A674 LY A675 LS A676, LA A676, LO A676, LY A676, LW A676 LS A679, LY A679, LG A679 - Hyper Micro SIDELED® LS Y876, LA Y876, LO Y876, LY Y876 LT Y87S - SmartLED LW L88C, LW L88S LB L89C, LB L89S, LG L890 LS L89K, LO L89K, LY L89K LS L896, LA L896, LO L896, LY L896 - TOPLED LS T670, LO T670, LY T670, LG T670, LP T670 LSG T670, LSP T670, LSY T670, LOP T670, LYG T670 LG T671, LOG T671, LSG T671 LB T673, LV T673, LT T673, LW T673 LH T674 LS T676, LA T676, LO T676, LY T676, LB T676, LH T676, LSB T676, LW T676 LB T67C, LV T67C, LT T67C, LS T67K, LO T67K, LY T67K, LW E67C LS E67B, LA E67B, LO E67B, LY E67B, LB E67C, LV E67C, LT E67C LW T67C LS T679, LY T679, LG T679 LS T770, LO T770, LY T770, LG T770, LP T770 LB T773, LV T773, LT T773, LW T773 LH T774 LS E675, LA E675, LY E675, LS T675 LS T776, LA T776, LO T776, LY T776, LB T776 LHGB T686 LT T68C, LB T68C - Hyper Mini TOPLED® LB M676 - Mini TOPLED Santana® LG M470 LS M47K, LO M47K, LY M47K Source: http://www.osram.convergy.de/
R1-R45 = rcl:R-US_: RESISTOR, American symbol
SPICS1-SPICS4 = Dean:TLP222A
TPS73133 = Dean:TPS76350DBVR
U$1 U$6-U$15 = Dean:FOD817B
U$2 = adafruit:BEAGLEBONE_OUTLINE: Should match A3 pinout - but not completely tested
U$3 = Dean:SN75LVDS83B
U$4 = Dean:0791077006
U$5 U$16 U$19-U$25 U$32 U$33 = Dean:DEAN_SMALL_VIA
U$17 = Dean:OSH_LOGO
U$18 = Dean:LM1117

## Board
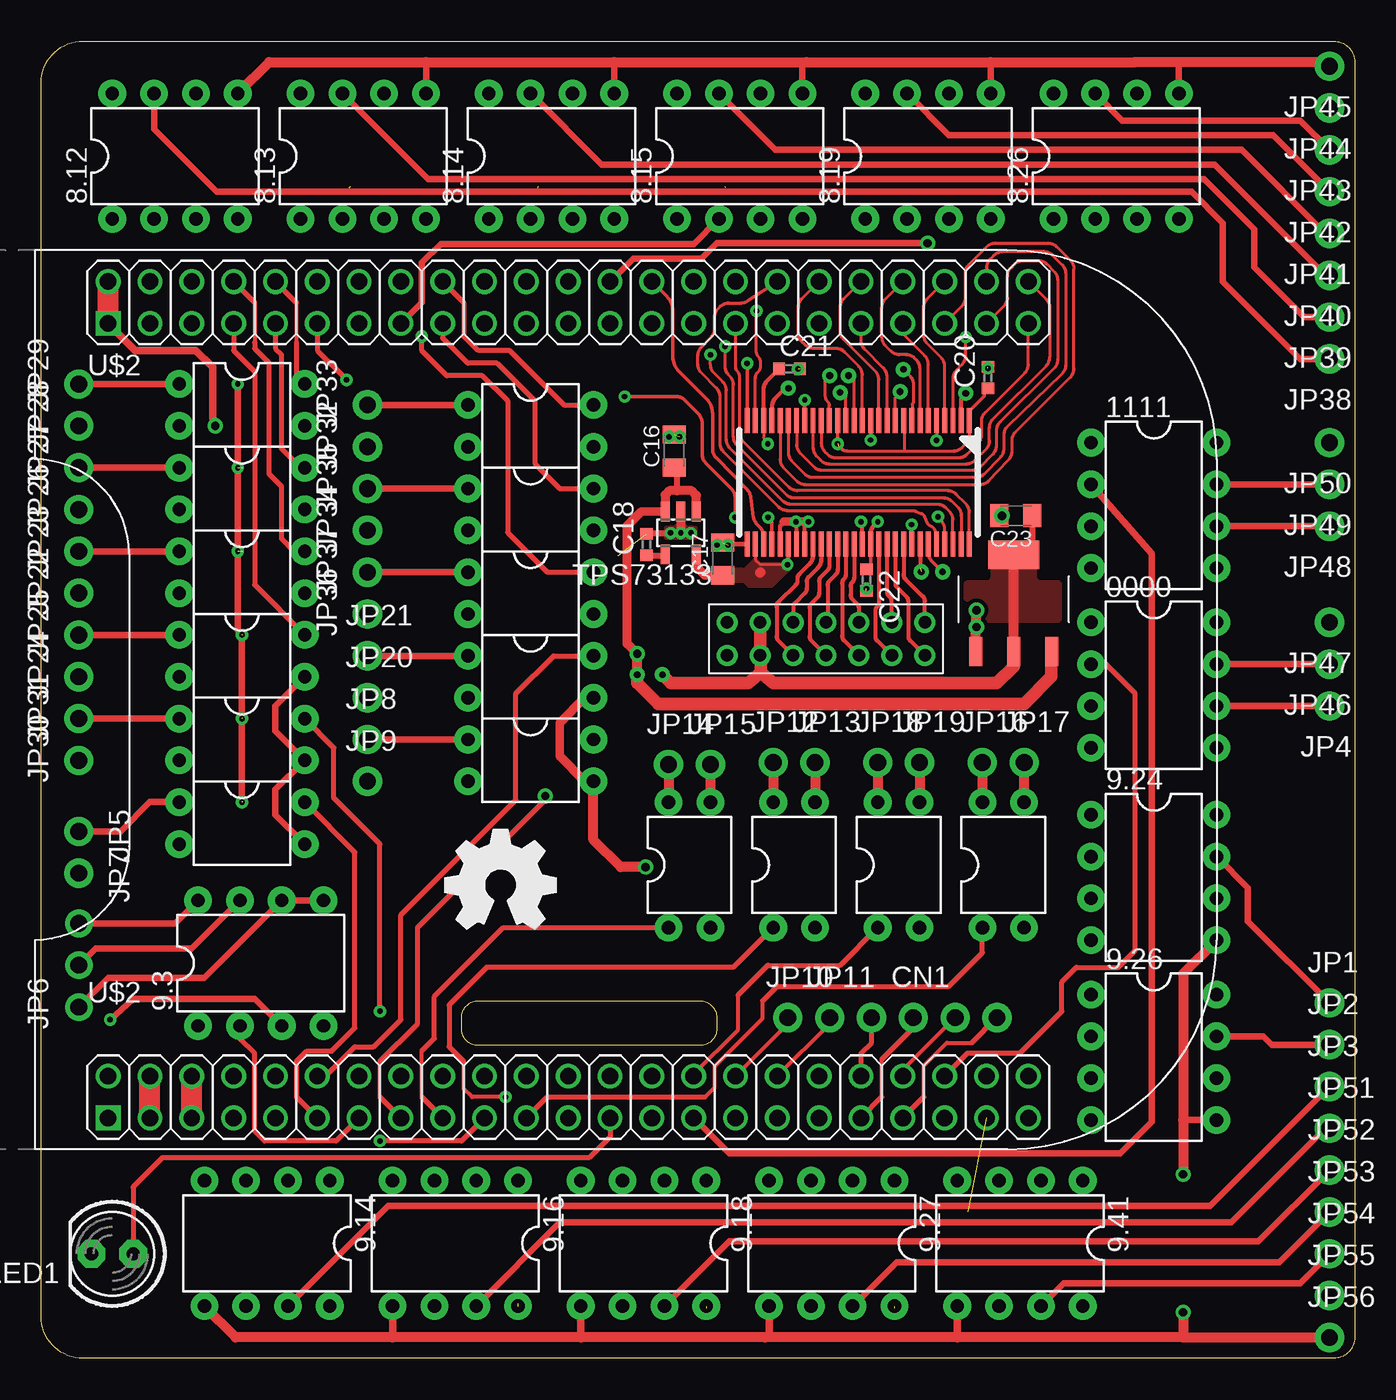
[diagram p5: board, top side]
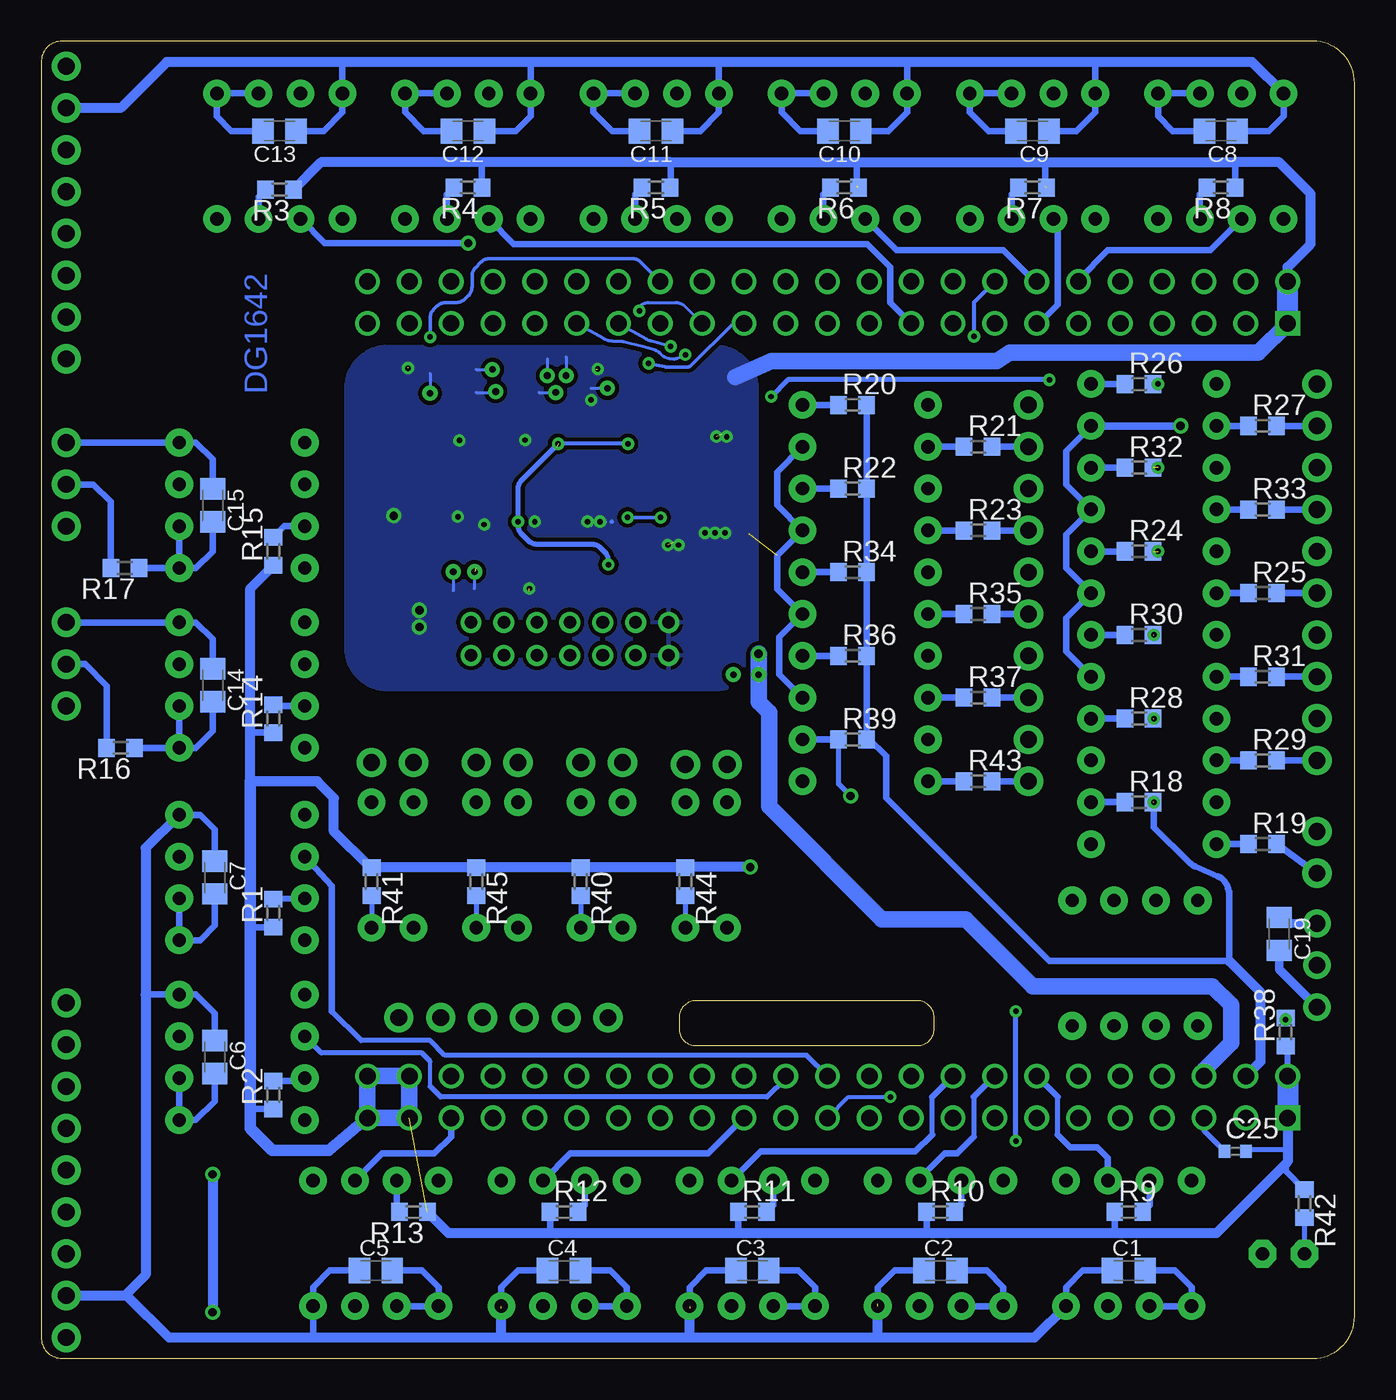
[diagram p6: board, bottom side, seen from below]

Size 79.76 x 80.01 mm. Coordinates in mm from the lower left corner, seen from the top.
Outline: 78.49,0 2.54,0 arc-90 0,2.54 0,77.47 arc-90 2.54,80.01 78.49,80.01 arc-90 79.76,78.74 79.76,1.27 arc-90 78.49,0
Outline: 25.53,20.02 25.53,20.7 arc-90 26.54,21.72 40.01,21.72 arc-90 41.02,20.7 41.02,20.02 arc-90 40.01,19 26.54,19 arc-90 25.53,20.02
Copper layers (1*16): Top 0.035mm / dielectric 1.5mm / Bottom 0.035mm
Design rules "default *": minimum track width 7mil, minimum drill 13mil, track to track 10mil, track to pad 10mil, pad to pad 10mil, via to via 10mil, smd to smd 6mil, copper to edge 15mil, drill to drill 8mil, minimum pad ring 10mil, minimum via ring 8mil, stop-mask expansion 0mil, vias tented up to drill 20mil, thermal gap 10mil

### Footprints (pad centres in the part's own frame; a part is rotated, then mirrored left to right if it is on the bottom)
DIL08-ROUND = drill 0.813 pad 1.676: 1 -3.81,-3.81; 2 -1.27,-3.81; 3 1.27,-3.81; 4 3.81,-3.81; 5 3.81,3.81; 6 1.27,3.81; 7 -1.27,3.81; 8 -3.81,3.81
C0805K = smd 1.3 x 1.524: 1 -1,0; 2 1,0
C0805K' = smd 1.1 x 1.4: 1 -1,0; 2 1,0
C0402 = smd 0.7 x 0.762: 1 -0.65,0; 2 0.65,0
1X04-CLEANBIG = drill 1.016 pad 1.778: 1 -3.81,0; 2 -1.27,0; 3 1.27,0; 4 3.81,0
1X01-CLEANBIG = drill 1.016 pad 1.778: 1 0,0
1X03-CLEANBIG = drill 1.016 pad 1.676: 1 -2.54,0; 2 0,0; 3 2.54,0
LED5MM = drill 0.813 pad 1.676 octagon: A -1.27,0; K 1.27,0
R0603 = smd 1 x 1.1: 1 -0.85,0; 2 0.85,0
DIL04-ROUND = drill 0.813 pad 1.676: 1 -1.27,-3.81; 2 1.27,-3.81; 3 1.27,3.81; 4 -1.27,3.81
SOT23-5L = smd 0.55 x 1.2: 1 -0.95,-1.3; 2 0,-1.3; 3 0.95,-1.3; 4 0.95,1.3; 5 -0.95,1.3
BEAGLEBONE_SHIELD = drill 1 square: 1 4.445,19.05; 47 52.705,19.05 | drill 1: 2 1.905,19.05; 3 4.445,21.59; 4 1.905,21.59; 5 4.445,24.13; 6 1.905,24.13; 7 4.445,26.67; 8 1.905,26.67; 9 4.445,29.21; 10 1.905,29.21; 11 4.445,31.75; 12 1.905,31.75; 13 4.445,34.29; 14 1.905,34.29; 15 4.445,36.83; 16 1.905,36.83; 17 4.445,39.37; 18 1.905,39.37; 19 4.445,41.91; 20 1.905,41.91; 21 4.445,44.45; 22 1.905,44.45; 23 4.445,46.99; 24 1.905,46.99; 25 4.445,49.53; 26 1.905,49.53; 27 4.445,52.07; 28 1.905,52.07; 29 4.445,54.61; 30 1.905,54.61; 31 4.445,57.15; 32 1.905,57.15; 33 4.445,59.69; 34 1.905,59.69; 35 4.445,62.23; 36 1.905,62.23; 37 4.445,64.77; 38 1.905,64.77; 39 4.445,67.31; 40 1.905,67.31; 41 4.445,69.85; 42 1.905,69.85; 43 4.445,72.39; 44 1.905,72.39; 45 4.445,74.93; 46 1.905,74.93; 48 50.165,19.05; 49 52.705,21.59; 50 50.165,21.59; 51 52.705,24.13; 52 50.165,24.13; 53 52.705,26.67; 54 50.165,26.67; 55 52.705,29.21; 56 50.165,29.21; 57 52.705,31.75; 58 50.165,31.75; 59 52.705,34.29; 60 50.165,34.29; 61 52.705,36.83; 62 50.165,36.83; 63 52.705,39.37; 64 50.165,39.37; 65 52.705,41.91; 66 50.165,41.91; 67 52.705,44.45; 68 50.165,44.45; 69 52.705,46.99; 70 50.165,46.99; 71 52.705,49.53; 72 50.165,49.53; 73 52.705,52.07; 74 50.165,52.07; 75 52.705,54.61; 76 50.165,54.61; 77 52.705,57.15; 78 50.165,57.15; 79 52.705,59.69; 80 50.165,59.69; 81 52.705,62.23; 82 50.165,62.23; 83 52.705,64.77; 84 50.165,64.77; 85 52.705,67.31; 86 50.165,67.31; 87 52.705,69.85; 88 50.165,69.85; 89 52.705,72.39; 90 50.165,72.39; 91 52.705,74.93; 92 50.165,74.93
DGG0056A = smd 1.5 x 0.3: P$1 -3.75,6.75; P$2 -3.75,6.25; P$3 -3.75,5.75; P$4 -3.75,5.25; P$5 -3.75,4.75; P$6 -3.75,4.25; P$7 -3.75,3.75; P$8 -3.75,3.25; P$9 -3.75,2.75; P$10 -3.75,2.25; P$11 -3.75,1.75; P$12 -3.75,1.25; P$13 -3.75,0.75; P$14 -3.75,0.25; P$15 -3.75,-0.25; P$16 -3.75,-0.75; P$17 -3.75,-1.25; P$18 -3.75,-1.75; P$19 -3.75,-2.25; P$20 -3.75,-2.75; P$21 -3.75,-3.25; P$22 -3.75,-3.75; P$23 -3.75,-4.25; P$24 -3.75,-4.75; P$25 -3.75,-5.25; P$26 -3.75,-5.75; P$27 -3.75,-6.25; P$28 -3.75,-6.75; P$29 3.75,-6.75; P$30 3.75,-6.25; P$31 3.75,-5.75; P$32 3.75,-5.25; P$33 3.75,-4.75; P$34 3.75,-4.25; P$35 3.75,-3.75; P$36 3.75,-3.25; P$37 3.75,-2.75; P$38 3.75,-2.25; P$39 3.75,-1.75; P$40 3.75,-1.25; P$41 3.75,-0.75; P$42 3.75,-0.25; P$43 3.75,0.25; P$44 3.75,0.75; P$45 3.75,1.25; P$46 3.75,1.75; P$47 3.75,2.25; P$48 3.75,2.75; P$49 3.75,3.25; P$50 3.75,3.75; P$51 3.75,4.25; P$52 3.75,4.75; P$53 3.75,5.25; P$54 3.75,5.75; P$55 3.75,6.25; P$56 3.75,6.75
0791077006 = drill 0.762 pad 1.067: 1 12,0; 2 12,-2; 3 10,0; 4 10,-2; 5 8,0; 6 8,-2; 7 6,0; 8 6,-2; 9 4,0; 10 4,-2; 11 2,0; 12 2,-2; 13 0,0; 14 0,-2
DEAN_SMALL_VIA = drill 0.406 pad 0.762: P$1 0,0
SOT223 = smd 0.8 x 1.75: 1 -2.3,-0.875; 2 0,-0.875; 3 2.3,-0.875 | smd 3.1 x 1.75: TAB 0,5

### Placement (x,y rotation side)
0000  67.56,40.89 270 top
8.12  8.13,73.03 0 top
8.13  19.56,73.03 0 top
8.14  30.99,73.03 0 top
8.15  42.42,73.03 0 top
8.19  53.85,73.03 0 top
8.26  65.28,73.03 0 top
9.3  13.34,24 0 top
9.14  13.72,6.99 180 top
9.16  25.15,6.99 180 top
9.18  36.58,6.99 180 top
9.24  67.56,29.21 270 top
9.26  67.56,18.29 270 top
9.27  48.01,6.99 180 top
9.41  59.44,6.99 180 top
1111  67.56,51.82 270 top
C1  13.72,5.33 0 bottom
C2  25.15,5.33 0 bottom
C3  36.58,5.33 0 bottom
C4  48.01,5.33 0 bottom
C5  59.44,5.33 0 bottom
C6  69.22,18.29 270 bottom
C7  69.22,29.21 270 bottom
C8  8.13,74.55 180 bottom
C9  19.56,74.55 180 bottom
C10  30.99,74.55 180 bottom
C11  42.42,74.55 180 bottom
C12  53.85,74.55 180 bottom
C13  65.28,74.55 180 bottom
C14  69.34,40.89 270 bottom
C15  69.34,51.82 270 bottom
C16  [C0805K']  38.43,55.12 90 top
C17  [C0805K']  41.38,48.56 90 top
C18  36.75,49.43 90 top
C19  4.57,25.78 270 bottom
C20  57.48,59.56 90 top
C21  45.44,60.1 0 top
C22  50.11,47.27 270 top
C23  10uf  [C0805K']  59.18,51.18 180 top
C25  7.24,12.57 0 bottom
CN1  54.23,20.7 0 top
JP1  78.23,21.59 0 top
JP2  78.23,19.05 0 top
JP3  78.23,16.51 0 top
JP4  78.23,39.62 180 top
JP5  2.29,32 270 top
JP6  2.29,23.88 90 top
JP7  2.29,29.46 270 top
JP8  19.81,37.59 0 top
JP9  19.81,35.05 0 top
JP10  45.34,20.7 0 top
JP11  47.88,20.7 0 top
JP12  44.45,36.2 0 top
JP13  46.99,36.2 0 top
JP14  38.1,36.07 0 top
JP15  40.64,36.07 0 top
JP16  57.15,36.2 0 top
JP17  59.69,36.2 0 top
JP18  50.8,36.2 0 top
JP19  53.34,36.2 0 top
JP20  19.81,40.13 0 top
JP21  19.81,42.67 0 top
JP22  2.29,46.48 90 top
JP23  2.29,49.02 90 top
JP24  2.29,41.4 90 top
JP25  2.29,43.94 90 top
JP26  2.29,51.56 90 top
JP27  2.29,54.1 90 top
JP28  2.29,56.64 90 top
JP29  2.29,59.18 90 top
JP30  2.29,36.32 90 top
JP31  2.29,38.86 90 top
JP32  19.81,55.37 90 top
JP33  19.81,57.91 90 top
JP34  19.81,50.29 90 top
JP35  19.81,52.83 90 top
JP36  19.81,45.21 90 top
JP37  19.81,47.75 90 top
JP38  78.23,60.71 180 top
JP39  78.23,63.25 180 top
JP40  78.23,65.79 180 top
JP41  78.23,68.33 180 top
JP42  78.23,70.87 180 top
JP43  78.23,73.41 180 top
JP44  78.23,75.95 180 top
JP45  78.23,78.49 180 top
JP46  78.23,42.16 180 top
JP47  78.23,44.7 180 top
JP48  78.23,50.55 180 top
JP49  78.23,53.09 180 top
JP50  78.23,55.63 180 top
JP51  78.23,13.97 0 top
JP52  78.23,11.43 0 top
JP53  78.23,8.89 0 top
JP54  78.23,6.35 0 top
JP55  78.23,3.81 0 top
JP56  78.23,1.27 0 top
LED1  4.32,6.35 180 top
R1  65.66,27.05 90 bottom
R2  65.66,16 90 bottom
R3  65.28,70.99 180 bottom
R4  53.85,71.12 180 bottom
R5  42.42,71.12 180 bottom
R6  30.99,71.12 180 bottom
R7  19.56,71.12 180 bottom
R8  8.13,71.12 180 bottom
R9  13.72,8.89 0 bottom
R10  25.15,8.89 0 bottom
R11  36.58,8.89 0 bottom
R12  48.01,8.89 0 bottom
R13  57.15,8.89 180 bottom
R14  65.66,38.86 90 bottom
R15  65.66,49.02 90 bottom
R16  74.93,37.08 180 bottom
R17  74.68,48.01 180 bottom
R18  13.08,33.78 0 bottom
R19  5.59,31.24 0 bottom
R20  30.48,57.91 0 bottom
R21  22.86,55.37 0 bottom
R22  30.48,52.83 0 bottom
R23  22.86,50.29 0 bottom
R24  13.08,49.02 0 bottom
R25  5.59,46.48 0 bottom
R26  13.08,59.18 0 bottom
R27  5.59,56.64 0 bottom
R28  13.08,38.86 0 bottom
R29  5.59,36.32 0 bottom
R30  13.08,43.94 0 bottom
R31  5.59,41.4 0 bottom
R32  13.08,54.1 0 bottom
R33  5.59,51.56 0 bottom
R34  30.48,47.75 0 bottom
R35  22.86,45.21 0 bottom
R36  30.48,42.67 0 bottom
R37  22.86,40.13 0 bottom
R38  4.19,19.81 90 bottom
R39  30.48,37.59 0 bottom
R40  46.99,28.96 270 bottom
R41  59.69,28.96 270 bottom
R42  3.05,9.4 270 bottom
R43  22.86,35.05 0 bottom
R44  40.64,28.96 270 bottom
R45  53.34,28.96 270 bottom
SPICS1  45.72,29.97 0 top
SPICS2  58.42,29.97 0 top
SPICS3  39.37,29.97 0 top
SPICS4  52.07,29.97 0 top
TPS73133  38.84,50.14 180 top
U$1  29.72,36.32 270 top
U$2  -14.99,67.31 270 top
U$3  49.62,53.21 270 top
U$4  41.66,44.7 0 top
U$5  37.72,41.53 90 top
U$6  12.19,32.51 270 top
U$7  29.72,56.64 270 top
U$8  29.72,51.56 270 top
U$9  12.19,47.75 270 top
U$10  12.19,57.91 270 top
U$11  12.19,37.59 270 top
U$12  12.19,42.67 270 top
U$13  12.19,52.83 270 top
U$14  29.72,46.48 270 top
U$15  29.72,41.4 270 top
U$16  36.2,41.53 90 top
U$17  24.38,25.91 0 top
U$18  59.05,43.81 0 top
U$19  56.14,58.62 180 top
U$20  53.44,47.78 270 top
U$21  52.36,60.07 270 top
U$22  52.16,58.72 270 top
U$23  48.51,58.67 270 top
U$24  47.88,59.69 270 top
U$25  45.37,58.93 270 top
U$32  54.74,47.78 90 top
U$33  49.02,59.69 90 top

### Tracks (layer width: path | path; a pad name or v marks a point on that pad's centre or on a via)
8.7
  Top 0.305: U$2.7 11.68,61.21 12.95,59.94 12.95,46.99 U$12.4
  Bottom 0.406: R30.1 U$12.4
8.8
  Top 0.229: 12.95,64.14 12.95,61.72
  Top 0.305: U$2.8 12.95,64.14 | U$9.4 15.37,49.02 14.61,49.78 14.61,52.96 13.84,53.72 13.84,60.45 12.95,61.34 12.95,61.72
  Bottom 0.406: R24.1 U$9.4
8.9
  Top 0.305: U$13.4 15.75,54.1 14.61,55.24 14.61,60.96 14.22,61.34 U$2.9
  Bottom 0.406: R32.1 U$13.4
8.10
  Top 0.229: 15.49,64.14 15.49,61.72
  Top 0.305: U$2.10 15.49,64.14 | 15.49,61.72 15.49,59.69 U$10.4
  Bottom 0.406: R26.1 U$10.4
8.11  (via drill 0.33)
  Top 0.203: U$3.P$32 44.37,50.73 v44.15,51.08 | v42.14,51.08 42.14,52.29 arc45 41.91,52.83 40.35,54.39 arc-45 40.13,54.93 40.13,56.83 arc45 39.91,57.37 39.09,58.2 arc45 38.55,58.42 v35.43,58.42
  Top 0.305: U$2.11 16.76,61.21 v18.54,59.44
  Bottom 0.203: v44.15,51.08 v42.14,51.08
  Bottom 0.305: v18.54,59.44 34.42,59.44 v35.43,58.42
8.12
  Bottom 0.406: U$2.12 16.76,65.53 14.99,67.31 8.76,67.31 8.12.2
8.13
  Bottom 0.406: U$2.13 19.18,62.87 18.03,64.01 18.03,68.96 8.13.2
8.14
  Bottom 0.406: U$2.14 19.43,65.41 21.34,67.31 27.81,67.31 8.14.2
8.15
  Top 0.406: U$2.15 23.11,64.14 23.11,66.55 24.26,67.69 39.62,67.69 8.15.2
8.16  (via drill 0.33)
  Top 0.305: U$14.4 30.73,47.75 28.32,50.16 28.32,58.17 26.8,59.69 24.64,59.69 23.11,61.21 v23.11,62.08
  Bottom 0.229: U$2.16 23.11,64.14 v23.11,62.08
  Bottom 0.406: R34.1 U$14.4
8.17
  Top 0.305: U$2.17 24.38,61.98 25.91,60.45 27.69,60.45 29.97,58.17 29.97,54.36 31.5,52.83 U$8.4
  Bottom 0.406: R22.1 U$8.4
8.18
  Top 0.305: U$2.18 25.65,64.14 25.65,62.1 26.54,61.21 28.45,61.21 31.75,57.91 U$7.4
  Bottom 0.406: R20.1 U$7.4
8.19
  Bottom 0.406: U$2.19 28.19,64.14 28.19,66.29 29.59,67.69 51.05,67.69 8.19.2
8.26  (via drill 0.51)
  Top 0.406: U$2.26 35.94,66.8 40.08,66.8 41.02,67.74 v53.82,67.74
  Bottom 0.406: v53.82,67.74 62.53,67.74 8.26.2
9.11
  Top 0.305: U$6.4 19.05,30.73 19.05,20.07 17.65,18.67 16.13,18.67 15.49,18.03 15.49,15.88 U$2.57
  Bottom 0.406: R18.1 U$6.4
9.12
  Top 0.305: U$2.58 17.27,17.14 19.05,18.92 20.19,18.92 21.84,20.57 21.84,26.92 28.83,33.91 28.83,40.39 31.11,42.67 U$15.4
  Bottom 0.406: R36.1 U$15.4
9.13
  Top 0.305: 9.3.2 12.06,19.43 12.95,18.54 12.95,13.82 13.56,13.21 17.91,13.21 U$2.59
9.14
  Bottom 0.305: 18.03,13.59 18.03,15.88
  Bottom 0.406: 18.03,13.59 17.27,12.83 15.62,12.83 14.99,12.19 9.14.2 | 18.03,15.88 U$2.60
9.15  (via drill 0.51)
  Top 0.229: 20.57,15.88 20.57,18.03
  Top 0.305: U$2.61 20.57,15.88 | 20.57,18.03 22.86,20.32 22.86,26.16 30.48,33.78 30.48,34.04 v30.61,34.16
  Bottom 0.305: v30.61,34.16 31.33,34.89 R39.1
  Bottom 0.406: R39.1 U$1.4
9.16
  Bottom 0.305: 23.11,15.88 23.11,13.46
  Bottom 0.406: 23.11,15.88 U$2.62 | 23.11,13.46 24.13,12.45 24.89,12.45 26.42,10.92 9.16.2
9.17
  Top 0.229: 23.11,15.88 23.11,18.67
  Top 0.305: 23.11,18.67 23.88,19.43 23.88,21.97 28.07,26.16 SPICS3.1 | U$2.63 23.11,15.88
9.18
  Bottom 0.305: 25.65,13.59 25.65,15.88
  Bottom 0.406: 25.65,13.59 26.67,12.57 36.07,12.57 9.18.2 | 25.65,15.88 U$2.64
9.19  (via drill 0.33)
  Top 0.305: U$2.65 25.53,13.21 v20.57,13.21 | v20.57,21.08 20.57,31.24 17.78,34.04 17.78,37.08 U$11.4
  Bottom 0.305: v20.57,13.21 v20.57,21.08
  Bottom 0.406: R28.1 U$11.4
9.21
  Top 0.229: 40.31,15.88 40.89,16.46 40.89,17.73 43.81,20.65 43.81,21.72
  Top 0.305: U$2.67 30.73,15.88 40.31,15.88 | SPICS2.1 57.15,24.64 55.12,22.61 44.7,22.61 43.81,21.72
9.23  (via drill 0.33)
  Top 0.229: v28.19,15.88 26.16,15.88 25.65,16.38 25.65,18.03
  Top 0.305: 25.65,18.03 24.77,18.92 24.77,21.46 27.05,23.75 42.04,23.75 SPICS1.1
  Bottom 0.229: U$2.69 30.73,15.88 v28.19,15.88
9.24
  Bottom 0.305: U$2.70 33.27,18.41 55.24,18.41 56.13,19.3 60.33,19.3 62.1,21.08
  Bottom 0.406: 62.1,21.08 62.1,28.7 9.24.2
9.25
  Top 0.305: U$2.71 34.54,13.46 33.27,12.19 7.37,12.19 5.59,10.41 LED1.A
9.26
  Bottom 0.254: 56.13,16.51 56.13,18.03
  Bottom 0.305: U$2.72 34.54,17.02 35.69,15.88 55.5,15.88 56.13,16.51 | 56.13,18.03 56.64,18.54 62.74,18.54 9.26.2
9.27
  Bottom 0.406: U$2.73 39.24,12.45 47.62,12.45 9.27.2
9.29
  Top 0.406: U$2.75 41.78,12.45 65.53,12.45 67.44,14.35 67.44,48.9 1111.2
9.30
  Top 0.229: U$2.76 39.62,17.27 42.32,19.96 42.32,22.07
  Top 0.305: SPICS4.1 48.51,23.88 44.12,23.88 42.32,22.07
9.32
  Top 0.229: U$2.78 45.34,20.32 JP10.1
9.34
  Top 0.229: U$2.80 47.88,20.32 JP11.1
9.37
  Top 0.229: 51.05,15.88 51.05,18.16 | 52.96,20.07 CN1.2
  Top 0.305: U$2.83 51.05,15.88 | 51.05,18.16 52.96,20.07
9.38
  Top 0.305: U$2.84 49.78,18.54 50.42,19.18 CN1.1
9.39
  Top 0.229: 53.59,15.88 53.59,17.78 54.99,19.18 56.52,19.18
  Top 0.305: U$2.85 53.59,15.88 | 56.52,19.18 CN1.4
9.40
  Top 0.229: 52.32,17.53 U$2.86
  Top 0.254: CN1.3 52.32,17.53
9.41
  Bottom 0.406: U$2.87 54.86,13.46 55.88,12.45 57.53,12.45 59.05,12.45 9.41.2
9.42
  Top 0.305: U$2.88 56.26,18.54 59.44,18.54 61.98,21.08 61.98,22.86 62.87,23.75 65.41,23.75 66.42,24.77 66.42,40.39 64.64,42.16 0000.2
+3V3  (via drill 0.33)  (5 unrouted)
  Top 0.406: v11.94,59.18 v11.94,54.1 v11.94,49.02 11.94,44.23 v12.19,43.94 v12.19,38.86 v12.19,33.78
  Top 1.27: U$2.49 U$2.50
  Bottom 0.305: R26.2 v11.94,59.18
  Bottom 0.406: v12.19,33.78 12.19,32.26 10.08,30.14 arc-22 9.68,29.88 8.3,29.29 arc22 7.99,29.07 arc45 7.62,28.18 7.62,24.13 18.54,24.13 28.45,34.04 28.45,36.58 29.46,37.59 R39.2 R36.2 R34.2 R22.2 R20.2
  Bottom 0.61: U$2.50 5.71,18.03 5.71,22.23 7.62,24.13
+5V/2
  Bottom 0.406: 61.59,78.74 61.47,78.74 8.26.8 61.47,75.69 62.61,74.55 C13.1 | 16,78.74 15.75,78.74 8.13.8 15.75,75.69 16.89,74.55 C9.1 | 27.69,78.74 27.18,78.74 8.14.8 27.18,75.69 28.32,74.55 C10.1 | 38.86,78.74 38.61,78.74 8.15.8 38.61,75.69 39.75,74.55 C11.1 | 50.04,78.74 8.19.8 50.04,75.44 50.93,74.55 C12.1 | C8.1 5.21,74.55 4.32,75.44 8.12.8
  Bottom 0.61: 8.12.8 6.22,78.74 16,78.74 27.69,78.74 38.86,78.74 50.04,78.74 61.59,78.74 72.14,78.74 74.93,75.95 JP44.1
DGND  (via drill 0.33, 0.51)  (10 unrouted)
  Top 0.178: U$3.P$13 v50.37,55.78 | U$3.P$5 | U$3.P$5 v54.37,55.75 | U$3.P$53 54.87,50.35 arc39 54.7,50.83 v54.46,51.13
  Top 0.254: U$3.P$21 v46.37,58.22 | U$3.P$29 42.87,49.91 | U$3.P$13 | U$3.P$43 49.87,50.67 v49.78,50.83 | U$3.P$36 46.37,50.61 v46.58,50.83 | U$3.P$35 45.87,50.53 v45.82,50.83 | U$3.P$49 52.87,50.72 v52.86,50.65 | U$3.P$33 44.87,50.54 45.09,50.83
  Top 0.279: U$3.P$29 41.83,49.46
  Top 0.305: 41.83,49.46 v41.71,49.4
  Top 0.356: 36.81,50.14 v38.23,50.14
  Top 0.406: U$6.3 14.22,33.02 14.22,34.54 U$11.3 14.22,38.1 14.22,39.62 U$12.3 | C18.2 36.81,50.14
  Top 0.457: v10.57,56.64 10.41,57.15 10.41,60.2 9.4,61.21 5.71,61.21 U$2.1
  Top 0.508: U$15.3 33.02,40.13 31.5,38.61 31.5,36.58 33.02,35.05 U$1.3 | 45.09,50.83 v46.58,50.83 | C23.2 v58.34,51.18
  Top 0.533: TPS73133.2 v38.84,50.14
  Top 0.61: v36.7,29.84 35.18,29.84 33.53,31.5 U$1.3 | 56.77,45.47 v56.79,45.44 v56.79,44.42 56.76,44.38 U$18.1
  Top 1.27: U$2.1 U$2.2
  Bottom 0.178: 53.47,47.75 53.47,46.74 | 54.74,47.75 54.74,46.61 | 47.88,60.83 47.88,59.94 | 49.02,60.71 49.02,59.94 | 49.53,58.67 48.64,58.67 | 53.34,58.67 52.32,58.67 | 53.34,60.07 52.58,60.07 | 46.35,58.93 45.59,58.93 | 56.13,59.82 56.13,58.8
  Bottom 0.254: v46.58,50.83 46.35,50.62 | v45.82,50.83 45.52,50.83 | 45.09,50.83 45.14,50.83
  Bottom 0.305: C25.2 6.46,12.7 4.06,12.7
  Bottom 0.356: U$2.48 4.06,18.96 R38.1
  Bottom 0.406: 26,7.62 25.91,7.62 | 37.43,7.62 37.34,7.62 | 41.53,71.16 41.53,72.64 | 30.23,71.21 30.23,72.64 | 18.8,71.21 18.8,72.64 | R8.1 7.24,71.29 7.24,72.64 | R2.1 67.06,15.15 67.06,15.24 | R4.1 53,72.64 53.09,72.64 | R14.1 67.06,38.01 | R1.1 65.66,26.16 67.06,26.16 | R10.1 26,7.62 | 26,7.62 26.04,7.62 | R11.1 37.43,7.62 | 37.43,7.62 37.47,7.62 | R12.1 48.86,7.62 49.02,7.62 | R9.1 14.57,7.62 14.48,7.62 | U$12.3 17.53,42.93 17.53,44.96 U$9.3 17.53,48.01 17.53,50.04 U$13.3 17.53,53.09 17.53,55.12 U$10.3 | U$15.3 34.92,41.53 34.92,43.81 U$14.3 35.05,46.74 35.05,48.77 U$8.3 35.05,51.82 35.05,53.85 U$7.3 | R42.1 4.19,11.39 4.19,11.81
  Bottom 0.457: U$10.3 v10.57,56.64
  Bottom 0.61: R3.1 62.78,72.64 53.09,72.64 41.53,72.64 30.23,72.64 18.8,72.64 7.24,72.64 4.57,72.64 2.67,70.74 2.67,67.69 4.06,66.29 U$2.2 | R15.1 67.06,46.77 67.06,38.01 67.06,35.05 62.99,35.05 61.98,34.04 61.98,32 59.78,29.81 R41.1 R45.1 R40.1 R44.1 40.6,29.84 v36.7,29.84 | U$2.47 4.06,12.7 4.06,11.94 4.19,11.81 8.38,7.62 14.48,7.62 25.91,7.62 26.04,7.62 37.34,7.62 37.47,7.62 49.02,7.62 55.03,7.62 R13.1
  Bottom 0.711: 67.06,35.05 67.06,26.16 67.06,15.24 67.06,13.97 65.73,12.65 62.28,12.65 U$2.91
  Bottom 1.016: U$2.1 5.84,61.09 20.95,61.09 21.72,60.58 35.43,60.58 37.62,59.61 | U$2.90 U$2.89 U$2.91 U$2.92 U$2.90
  Bottom 1.27: U$2.1 U$2.2 | U$2.48 U$2.47
  other vias: 57.48,60.15 45.96,60.1 50.11,46.76 41.05,49.4 38.13,55.98 38.76,55.98 39.45,50.14
  pour Bottom: 58.67,61.47 38.86,61.47 arc90 36.32,58.93 36.32,43.15 arc90 38.86,40.61 58.67,40.61 arc90 61.21,43.15 61.21,58.93 arc90
  pour Top (no thermals): 39.09,50.72 39.23,50.58 arc45 39.32,50.55 39.73,50.55 arc-90 39.85,50.42 39.85,49.86 arc-90 39.73,49.73 37.95,49.73 arc-90 37.82,49.86 37.82,50.42 arc-90 37.95,50.55 38.35,50.55 arc45 38.44,50.58 38.58,50.72
  pour Top (no thermals): 44.75,50.57 44.86,50.9 45.11,50.6 44.98,50.47
GND2  (via drill 0.51)
  Top 0.406: 9.26.5 69.34,14.48
  Top 0.457: 9.41.5 55.63,1.27 | 9.27.5 44.2,1.27 43.94,1.27 | 9.16.5 21.34,1.27 | 9.18.5 32.77,1.27
  Top 0.61: 9.24.5 69.34,23.37 69.34,14.48 v69.34,11.18 | 69.34,1.27 55.63,1.27 43.94,1.27 32.77,1.27 21.34,1.27 11.81,1.27 9.14.5 | v69.34,2.79 69.34,1.27 | 69.34,1.27 JP56.1
  Bottom 0.406: 9.41.6 9.41.5 55.63,4.32 56.64,5.33 C5.2 | 9.27.6 9.27.5 44.2,4.32 45.21,5.33 C4.2 | 9.18.6 9.18.5 32.77,4.32 33.78,5.33 C3.2 | 9.16.6 9.16.5 21.34,4.32 22.35,5.33 C2.2 | 9.14.6 9.14.5 9.91,4.32 10.92,5.33 C1.2 | 9.26.6 9.26.5 70.36,14.48 69.22,15.62 C6.2 | 9.24.6 9.24.5 70.1,25.4 69.22,26.29 C7.2
  Bottom 0.61: v69.34,11.18 v69.34,2.79
HSYNC  (via drill 0.33)
  Top 0.178: U$3.P$27 43.37,59.54 arc-45 43.52,59.9 43.54,59.92 arc45 43.69,60.28 43.69,60.5 arc45 43.54,60.85 arc-45 43.43,61.11 v43.43,63.63
  Bottom 0.178: v43.43,63.63 43.43,63.88 43.4,63.91 arc45 42.86,64.14 41.21,64.14 arc45 40.67,63.91 U$2.29
N$1
  Bottom 0.406: 9.24.3 63.97,27.94 R1.2
N$2
  Top 0.356: C23.1 60.18,48.81
  Top 0.508: 60.18,48.81 U$18.TAB
  Top 0.61: 59.05,42.04 U$18.2 U$18.TAB | 43.69,42.67 U$4.12
  Top 0.762: U$4.12 U$4.11 | 59.05,42.04 58.04,41.02 44.45,41.02 43.69,41.66 | 43.69,41.66 43.69,42.67 | U$5.P$1 38.23,41.02 42.93,41.02 43.69,41.66
  pour Top (no thermals): 60.45,48.26 60.45,47.5 arc90 60.71,47.24 61.72,47.24 arc-90 61.98,46.99 61.98,44.96 arc-90 61.72,44.7 56.64,44.7 56.64,45.97 56.26,45.97 arc-90 56.01,46.23 56.01,46.99 arc-90 56.26,47.24 57.4,47.24 arc90 57.66,47.5 57.66,48.26
N$4
  Bottom 0.406: R2.2 63.75,16.85 9.26.3
N$6
  Bottom 0.406: 8.26.3 66.55,70.57 R3.2
N$8
  Bottom 0.406: 8.19.3 55.12,70.7 R4.2
N$10
  Bottom 0.406: 8.15.3 43.69,70.7 R5.2
N$12
  Bottom 0.406: 8.14.3 32.26,70.7 R6.2
N$14
  Bottom 0.406: 8.13.3 20.83,70.7 R7.2
N$16
  Bottom 0.406: 8.12.3 9.4,70.7 R8.2
N$17
  Top 0.406: 9.26.7 74.22,19.56 74.73,19.05 JP2.1
N$18
  Bottom 0.406: 9.14.3 12.45,9.31 R9.2
N$19
  Top 0.406: 9.24.7 73.28,28.57 73.28,26.54 JP1.1
N$20
  Bottom 0.406: 9.16.3 23.88,9.31 R10.2
N$22
  Bottom 0.406: 9.18.3 35.31,9.31 R11.2
N$23
  Top 0.305: 36.72,48.81 C18.1
  Top 0.356: C18.1 37.76,48.78
  Top 0.406: 37.76,48.78 TPS73133.4
N$24
  Bottom 0.406: 9.27.3 46.74,9.31 R12.2
N$26
  Bottom 0.406: 9.41.3 58.17,9.31 R13.2
N$31
  Bottom 0.406: 0000.3 64.98,39.62 R14.2
N$32
  Bottom 0.406: 1111.3 64.98,50.55 R15.2
N$33
  Top 0.406: JP4.1 0000.6
  Bottom 0.406: C14.2 69.34,38.1 70.36,37.08 0000.5 | 0000.6 0000.5 | 0000.5 R16.1
N$34
  Top 0.406: JP48.1 1111.6
  Bottom 0.406: C15.2 69.34,49.02 70.36,48.01 1111.5 | 1111.6 1111.5 | R17.1 1111.5
N$35
  Top 0.406: 9.14.7 21.08,9.27 70.99,9.27 JP3.1
N$36
  Top 0.406: 9.16.7 31.5,8.26 72.26,8.26 77.98,13.97 JP51.1
N$37
  Top 0.406: 9.18.7 41.78,7.11 73.91,7.11 JP52.1
N$38
  Top 0.406: 9.27.7 51.94,5.84 75.18,5.84 JP53.1
N$39
  Top 0.406: 9.41.7 62.1,4.57 76.45,4.57 JP54.1
N$45
  Bottom 0.406: C14.1 69.34,43.69 70.36,44.7 0000.8 JP47.1
N$46
  Bottom 0.406: C15.1 69.34,54.61 70.36,55.63 1111.8 JP50.1
N$47
  Top 0.406: 1111.7 JP49.1
  Bottom 0.406: R17.2 75.53,52.03 76.58,53.09 JP49.1
N$48
  Top 0.406: 0000.7 JP46.1
  Bottom 0.406: R16.2 75.78,40.85 77.09,42.16 JP46.1
N$49
  Top 0.406: 8.12.7 6.86,74.68 10.67,70.87 69.85,70.87 71.75,68.96 71.75,65.41 76.45,60.71 JP38.1
N$50
  Top 0.406: 8.13.7 23.5,71.63 70.61,71.63 73.66,68.58 73.66,66.29 76.71,63.25 JP39.1
N$51
  Top 0.406: 8.14.7 34.04,72.52 71.25,72.52 77.98,65.79 JP40.1
N$52
  Top 0.406: 8.15.7 44.58,73.41 72.9,73.41 77.98,68.33 JP41.1
N$53
  Top 0.406: 8.19.7 55.12,74.3 74.8,74.3 JP42.1
N$54
  Top 0.406: 8.26.7 65.66,75.18 76.45,75.18 JP43.1
N$55
  Top 0.178: U$3.P$19 47.37,55.6 arc45 47.59,55.06 47.72,54.94 arc45 48.26,54.71 55.69,54.71 arc45 56.23,54.94 56.93,55.63 arc45 57.1,56.12 57.1,56.91 arc-45 57.32,57.45 59.72,59.85 arc45 59.94,60.39 U$2.45
N$56
  Top 0.178: U$2.46 61.02,64.33 arc-45 61.24,63.79 61.24,60.82 arc-45 61.02,60.28 57.8,57.07 arc45 57.58,56.53 57.58,55.76 arc-45 57.44,55.3 56.69,54.55 arc-45 56.15,54.33 47.88,54.33 arc-45 47.34,54.55 47.09,54.8 arc-45 46.87,55.34 U$3.P$20
N$57
  Top 0.178: U$3.P$22 45.87,55.53 arc45 46.09,54.99 46.9,54.17 arc45 47.44,53.95 56.5,53.95 arc45 57.04,54.17 57.79,54.92 arc45 58.01,55.46 58.01,56.35 arc-45 58.24,56.89 61.5,60.13 arc45 61.72,60.67 61.72,65.5 arc45 61.5,66.03 61.08,66.45 arc45 60.54,66.67 59.62,66.67 arc45 59.09,66.45 58.9,66.26 arc45 58.67,65.72 58.67,64.45 arc-45 58.45,63.91 U$2.43
N$58
  Top 0.178: U$3.P$23 45.37,55.03 arc45 45.59,54.5 46.34,53.74 arc45 46.88,53.52 56.75,53.52 arc46 57.3,53.75 58.26,54.74 arc44 58.47,55.27 58.47,56.1 arc-45 58.69,56.64 62.01,59.82 arc45 62.23,60.36 62.23,65.88 arc45 62.01,66.42 61.44,66.98 arc45 60.9,67.21 58.38,67.21 arc45 57.84,66.98 57.63,66.77 arc45 57.4,66.23 U$2.44
N$59
  Top 0.178: U$2.41 55.91,63.91 arc45 56.13,64.45 56.13,65.93 arc-45 56.36,66.47 57.41,67.52 arc-45 57.95,67.74 61.13,67.74 arc-45 61.67,67.52 62.49,66.69 arc-45 62.71,66.16 62.71,60.13 arc-45 62.49,59.59 59.18,56.28 arc45 58.95,55.74 58.95,55.1 arc-45 58.73,54.56 57.55,53.31 arc-45 57.01,53.09 46.4,53.09 arc-45 45.86,53.31 45.09,54.08 arc-45 44.87,54.62 U$3.P$24
N$60
  Top 0.178: U$2.42 53.82,64.36 arc45 53.59,63.82 53.59,62.16 arc45 53.82,61.63 54.64,60.8 arc-45 54.87,60.26 U$3.P$4
  Top 0.254: U$3.P$4
N$63
  Top 0.178: U$3.P$6 53.87,60.37 arc45 53.64,60.91 52.32,62.23 U$2.39
N$64
  Top 0.178: U$3.P$7 53.37,60.11 arc45 53.14,60.65 53.05,60.74 arc45 52.52,60.96 52.13,60.96 arc-45 51.59,61.18 51.28,61.5 arc-45 51.05,62.04 51.05,63.82 arc-45 51.28,64.36 U$2.40
N$65
  Top 0.178: U$3.P$11 51.37,59.62 arc45 51.14,60.16 50.01,61.3 arc-45 49.78,61.83 U$2.37
N$66
  Top 0.178: U$3.P$12 50.87,59.44 arc45 50.64,59.97 48.74,61.88 arc-45 48.51,62.42 48.51,63.82 arc-45 48.74,64.36 U$2.38
N$67
  Top 0.178: U$3.P$14 49.87,59.73 arc45 49.64,60.27 48.79,61.12 arc45 48.25,61.34 46.92,61.34 arc-45 46.39,61.56 46.2,61.75 arc-45 45.97,62.29 45.97,63.82 arc-45 46.2,64.36 U$2.36
N$68
  Top 0.178: U$3.P$52 54.37,49.96 arc40 54.19,50.44 54.19,50.44 arc23 54.11,50.51 53.94,50.6 arc-39 53.82,50.72 53.65,51.13 arc45 53.45,51.32 53.14,51.45 arc22 52.95,51.49 45.32,51.49 arc-45 44.79,51.71 41.45,55.05 arc-45 41.22,55.59 41.22,58.41 arc45 41,58.95 40.1,59.85 arc-45 39.88,60.39 39.88,60.9 arc-45 40.1,61.44 40.67,62.01 arc45 40.89,62.55 40.89,63.23 arc-45 41.12,63.77 41.23,63.89 arc-45 41.77,64.11 42.5,64.11 arc33 42.91,64.23 U$2.34
N$69  (via drill 0.33)
  Top 0.178: U$3.P$54 55.37,50.92 arc45 55.14,51.46 54.96,51.64 arc45 54.42,51.87 45.55,51.87 arc-45 45.01,52.09 41.83,55.28 arc-45 41.6,55.81 41.6,58.79 arc45 41.38,59.33 40.86,59.85 arc-45 40.64,60.39 v40.64,60.96
  Bottom 0.178: v40.64,60.96 41.21,60.73 arc22 41.35,60.71 41.38,60.71 arc22 41.85,60.8 arc29 42.12,60.99 arc-33 42.48,61.23 43.23,61.47 44.35,61.74 arc-13 44.65,61.77 44.98,61.77 arc30 45.6,61.94 U$2.35
N$70  (via drill 0.33)
  Top 0.178: U$3.P$55 55.87,51.18 arc45 55.64,51.72 55.32,52.05 arc45 54.78,52.27 45.76,52.27 arc-45 45.22,52.5 42.26,55.45 arc-45 42.04,55.99 42.04,59.12 arc45 41.81,59.66 41.75,59.72 arc-45 41.53,60.26 v41.53,61.47
  Top 0.203: v41.53,61.47 41.53,61.21
  Bottom 0.178: v41.53,61.47 42.72,61.78 arc15 43.02,61.91 U$2.33
N$71
  Top 0.178: U$3.P$56 56.37,51.37 arc45 56.14,51.91 55.57,52.48 arc45 55.03,52.7 45.93,52.7 arc-45 45.4,52.93 42.64,55.68 arc-45 42.42,56.22 42.42,59.61 arc45 42.27,59.97 arc-45 42.16,60.22 U$2.31
N$72  (via drill 0.33)
  Top 0.178: U$3.P$3 55.37,59.5 arc-45 55.59,60.04 55.91,60.36 arc45 56.13,60.9 v56.13,62.04
  Top 0.254: U$3.P$3
  Bottom 0.203: U$2.32 43.34,66.58 arc-45 43.88,66.8 52.52,66.8 arc-45 53.05,66.58 53.37,66.26 arc-45 53.59,65.72 53.59,65.09 arc45 53.82,64.55 54.01,64.36 arc45 54.55,64.14 55.18,64.14 arc-45 55.72,63.91 55.91,63.72 arc-45 56.13,63.18 v56.13,62.04
N$73
  Top 0.254: U$3.P$2 55.87,58.27 U$19.P$1
N$74  (1 unrouted)
  Top 0.254: U$3.P$50 53.37,48.01
N$75
  Top 0.178: U$21.P$1 52.74,59.7 arc-45 52.96,59.16 52.96,58.04 52.88,57.94 52.88,57 U$3.P$8
N$76
  Top 0.178: U$3.P$10 51.87,58.36 U$22.P$1
N$77
  Top 0.178: U$3.P$16 48.87,58.41 U$23.P$1
N$78
  Top 0.178: U$3.P$18 47.87,57.85 arc45 47.76,58.12 47.74,58.14 arc-45 47.62,58.41 47.62,59.44 U$24.P$1
N$79
  Top 0.254: U$3.P$25 44.37,57.81 arc-45 44.59,58.35 45.17,58.93 U$25.P$1
N$83
  Top 0.61: JP12.1 SPICS1.4
N$84
  Top 0.254: U$3.P$48 52.37,47.61 arc45 52.48,47.34 53.54,46.28 arc-45 53.66,46.01 U$4.1
N$85
  Top 0.254: U$3.P$47 51.87,47.1 arc45 51.98,46.83 52.54,46.26 arc-45 52.65,45.99 52.65,43.86 arc45 52.77,43.59 U$4.2
N$86
  Top 0.254: U$3.P$46 51.37,46.58 arc45 51.48,46.31 51.53,46.26 arc-45 51.64,45.99 51.64,44.72 U$4.3
N$87
  Top 0.254: U$3.P$45 50.87,45.91 arc-45 50.76,45.65 arc45 50.65,45.38 50.65,43.87 arc45 50.76,43.6 U$4.4
N$88
  Top 0.254: U$3.P$42 49.37,47.41 arc-45 49.26,47.15 arc45 49.15,46.88 49.15,46.39 arc45 49.26,46.12 49.54,45.83 arc-45 49.66,45.56 U$4.5
N$89
  Top 0.254: U$3.P$41 48.87,47.63 arc-45 48.76,47.36 48.75,47.36 arc45 48.64,47.09 48.64,43.88 arc45 48.75,43.61 U$4.6
N$90
  Top 0.254: U$3.P$40 48.37,47.89 arc-45 48.26,47.62 47.86,47.23 arc45 47.75,46.96 47.75,44.8 U$4.7
N$91
  Top 0.254: U$3.P$39 47.87,48.15 arc-45 47.76,47.88 47.36,47.48 arc45 47.24,47.21 47.24,46.49 arc-45 47.13,46.22 46.77,45.86 arc45 46.66,45.59 46.66,43.86 arc45 46.77,43.59 U$4.8
N$92
  Top 0.254: U$3.P$38 47.37,48.55 arc-45 47.14,48.01 46.59,47.46 arc45 46.48,47.19 46.48,46.74 arc-45 46.37,46.47 45.78,45.88 arc45 45.67,45.61 45.67,44.72 U$4.9
N$93
  Top 0.254: U$3.P$37 46.87,48.78 arc-45 46.64,48.24 46.03,47.63 arc45 45.92,47.37 45.92,47.25 arc-45 45.81,46.98 44.77,45.93 arc45 44.65,45.66 44.65,43.87 arc45 44.77,43.59 U$4.10
N$94
  Top 0.406: JP21.1 U$15.1
N$97
  Bottom 0.406: 7.96,31.24 U$6.2 R19.1
N$100
  Top 0.203: U$3.P$51 53.87,48.96 arc45 54.09,48.42 U$32.P$1
N$101
  Top 0.178: U$3.P$15 49.37,59.43 U$33.P$1
N$102
  Top 0.61: JP13.1 SPICS1.3
N$103
  Top 0.61: JP14.1 SPICS3.4
N$104
  Top 0.61: JP15.1 SPICS3.3
N$105  (via drill 0.51)
  Top 0.305: C16.1 38.45,54.1 38.61,54.1
  Top 0.356: 38.61,54.1 38.61,52.7
  Top 0.508: 35.59,50.57 36.45,51.44 TPS73133.3 | U$18.3 61.35,43.58
  Top 0.533: TPS73133.3 37.89,52.45 38.15,52.7 38.61,52.7 39.5,52.7 39.79,52.41 TPS73133.1 | v36.2,42.8 35.59,43.41 35.59,50.57
  Top 0.61: U$18.3 61.34,42.42 | U$16.P$1 v36.2,42.8
  Top 0.762: 61.34,42.42 61.34,41.4 59.69,39.75 37.47,39.75 36.2,41.02 U$16.P$1
  Top 1.27: U$2.51 U$2.52
  Bottom 0.305: C25.1 9.14,13.83 U$2.51
  Bottom 1.016: U$2.52 9.14,17.53 7.49,19.18 7.49,21.46 8.64,22.61 19.56,22.61 23.62,26.67 28.7,26.67 35.56,33.53 35.56,39.24 36.2,39.88 U$16.P$1 v36.2,42.8
N$106
  Bottom 0.406: R21.1 U$7.2
N$108
  Bottom 0.406: R23.1 U$8.2
N$110
  Bottom 0.406: R25.1 U$9.2
N$111
  Bottom 0.305: R45.2 SPICS4.2
N$112
  Bottom 0.406: R27.1 U$10.2
N$114
  Bottom 0.406: R29.1 U$11.2
N$116
  Bottom 0.406: R31.1 U$12.2
N$117
  Top 0.61: JP16.1 SPICS2.4
N$118
  Bottom 0.406: R33.1 U$13.2
N$120
  Bottom 0.406: R35.1 U$14.2
N$122
  Bottom 0.406: R37.1 U$15.2
N$123  (via drill 0.33)
  Top 0.406: 9.3.3 12.95,21.84 5.59,21.84 v4.19,20.57
  Bottom 0.406: v4.19,20.57 4.41,20.7 R38.2
N$125
  Bottom 0.305: R40.2 SPICS1.2
N$126
  Bottom 0.305: R41.2 SPICS2.2
N$127
  Bottom 0.305: R42.2 LED1.K
N$129
  Top 0.406: 9.3.7 9.14,24.89 3.3,24.89 JP6.2
N$130
  Top 0.406: 9.3.5 9.3.6 9.91,23.11 4.06,23.11 JP6.1
  Bottom 0.508: JP6.1 4.57,23.62 C19.2
N$132
  Top 0.406: U$6.1 6.6,33.78 4.83,32 JP5.1
N$133
  Bottom 0.406: R19.2 JP7.1
N$134
  Bottom 0.406: R43.1 U$1.2
N$135
  Top 0.406: JP8.1 U$1.1
N$136
  Bottom 0.406: R43.2 JP9.1
N$137
  Top 0.406: 9.3.8 8.13,26.42 JP6.3
  Bottom 0.508: JP6.3 4.57,26.42 C19.1
N$139
  Bottom 0.305: R44.2 SPICS3.2
N$142
  Top 0.61: SPICS2.3 JP17.1
N$143
  Top 0.61: JP19.1 SPICS4.3
N$144
  Top 0.61: JP18.1 SPICS4.4
N$146
  Bottom 0.406: R37.2 JP20.1
N$147
  Bottom 0.406: R35.2 JP36.1
N$148
  Top 0.406: U$14.1 JP37.1
N$149
  Bottom 0.406: R23.2 JP34.1
N$150
  Top 0.406: U$8.1 JP35.1
N$151
  Bottom 0.406: R21.2 JP32.1
N$152
  Top 0.406: U$7.1 JP33.1
N$153
  Bottom 0.406: R29.2 JP30.1
N$154
  Top 0.406: U$11.1 JP31.1
N$155
  Bottom 0.406: R27.2 JP28.1
N$156
  Top 0.406: U$10.1 JP29.1
N$157
  Bottom 0.406: R33.2 JP26.1
N$158
  Top 0.406: U$13.1 JP27.1
N$159
  Bottom 0.406: R31.2 JP24.1
N$160
  Top 0.406: U$12.1 JP25.1
N$161
  Bottom 0.406: R25.2 JP22.1
N$162
  Top 0.406: U$9.1 JP23.1
PCLK
  Top 0.203: U$3.P$31 43.87,49.95 arc45 43.64,50.49 43.46,50.67 arc-37 43.25,51.11 43.09,52.33 arc37 42.88,52.76 41.02,54.68 40.99,54.71 arc-45 40.77,55.25 40.77,57.39 arc45 40.4,58.28 38.73,59.95 arc-45 38.35,60.85 38.35,63.61 arc45 37.98,64.51 U$2.28
V-
  Top 0.406: 8.13.5 23.37,78.74 | 8.14.5 34.8,78.74 | 8.15.5 46.23,78.74 46.48,78.74 | 8.19.5 57.66,78.74 | 66.55,78.74 69.09,78.74 8.26.5
  Top 0.61: 8.12.5 13.84,78.74 23.37,78.74 34.8,78.74 46.48,78.74 57.66,78.74 66.42,78.74 66.55,78.74 77.98,78.74 JP45.1
  Bottom 0.406: 8.12.6 8.12.5 11.94,75.44 11.05,74.55 C8.2 | 8.13.6 8.13.5 23.37,75.69 22.23,74.55 C9.2 | 8.14.6 8.14.5 34.8,75.69 33.66,74.55 C10.2 | 8.15.6 8.15.5 46.23,75.69 45.09,74.55 C11.2 | 8.19.6 8.19.5 57.66,75.69 56.52,74.55 C12.2 | 8.26.6 8.26.5 69.09,75.44 68.2,74.55 C13.2
VCC/2  (via drill 0.33)  (1 unrouted)
  Top 0.178: U$3.P$1 56.36,56.89 56.36,56.09 arc-45 56.14,55.55 55.9,55.32 arc-45 55.36,55.09 52.4,55.09 | U$3.P$26 43.87,55.93 v44.12,55.55 | v48.36,55.55 v48.37,55.55 U$3.P$17 | 52.4,55.09 49.02,55.09 arc-50 48.44,55.37 | U$3.P$9 52.4,56.93 52.4,55.09 | U$3.P$30 43.37,48.51 43.64,48.23 v45.31,48.21 45.34,48.36 | 45.39,49.44 U$3.P$34 | U$3.P$44 50.37,50.08
  Top 0.203: 56.37,57.53 57.28,58.45 57.28,58.67 C20.1 | C22.1 50.37,48.22 U$3.P$44
  Top 0.229: 50.37,50.08 arc-45 50.59,50.62 v50.8,50.83
  Top 0.254: 45.39,49.44 45.34,48.36 | U$3.P$26 43.87,58.86 arc-45 44.09,59.4 C21.1
  Top 0.305: U$3.P$1 56.37,57.53
  Top 0.508: 41.22,47.41 C17.1
  Top 0.533: TPS73133.5 39.79,48.1 40.32,47.56 C17.1
  Top 0.61: 43.66,47.72 43.69,47.75
  Bottom 0.254: v44.12,55.55 v48.36,55.55
  Bottom 0.305: v45.31,48.21 45.31,48.45 arc-45 45.54,48.99 45.78,49.23 arc-45 46.31,49.45 49.65,49.45 arc45 50.19,49.68 50.58,50.07 arc45 50.8,50.61 v50.8,50.83 50.8,52.8 arc45 50.58,53.34 v48.36,55.55
  pour Top (no thermals): 41.4,48.01 42.7,48.01 43.33,48.64 43.41,48.64 43.66,48.34 45.59,48.34 45.59,48.01 44.4,46.81 42.93,46.81 42.72,47.04 42.65,47.12 41.4,47.12
VSYNC  (via drill 0.33)
  Top 0.203: v42.87,60.44 U$3.P$28
  Bottom 0.203: v42.87,60.44 41.88,60.23 arc-12 41.62,60.2 40.6,60.2 arc-45 40.24,60.35 37.87,62.72 arc45 37.51,62.87 U$2.27
XXXXXX  (3 unrouted)
  Bottom 0.406: 9.27.8 51.82,4.32 50.8,5.33 C4.1 | 9.18.8 40.39,4.32 39.37,5.33 C3.1 | 9.14.8 17.53,4.32 16.51,5.33 C1.1 | 9.24.8 70.1,33.02 69.22,32.13 C7.1 | 28.96,3.3 28.96,4.32 27.94,5.33 C2.1 | 73.41,22.1 9.26.8 70.36,22.1 69.22,20.95 C6.1 | C5.1 62.23,5.33 63.25,4.32 9.41.8 63.25,1.27
  Bottom 0.61: 51.82,1.27 63.25,1.27 72.01,1.27 74.55,3.81 74.68,3.81 | 51.82,1.27 40.39,1.27 | 40.39,1.27 28.96,1.27 | 28.96,1.27 19.43,1.27 9.14.8 | 51.82,1.27 51.82,3.05 | 40.39,1.27 40.39,3.05 | 28.96,1.27 28.96,3.3 | 74.68,3.81 73.41,5.08 73.41,22.1 73.41,30.99 9.24.8 | 74.68,3.81 JP55.1

### Text on the board
Bottom: DG1642
DEAN_SILK: GE4 | VE4 | 8.12 | 8.13 | 8.14 | 8.15 | 8.19 | 8.26 | 8.26 | 8.19 | 8.15 | 8.14 | 8.13 | 8.12 | + | + | 8.10 | - | 8.10 | 8.18 | - | 8.18 | VE3 | + | + | 9.29 | 8.9 | - | 8.9 | 8.17 | - | 8.17 | 9.29 | GE3 | + | 8.8 | - | 8.8 | + | 8.16 | 8.16 | - | + | VE2 | LVDS | 8.7 | - | 8.7 | + | 9.42 | 9.12 | 9.12 | - | + | 9.17 | 9.23 | 9.30 | 9.21 | 9.42 | GE2 | 9.19 | - | 9.19 | + | 9.15 | - | 9.15 | + | 9.11 | 9.11 | - | 9.17 | 9.23 | 9.30 | 9.21 | 9.24 | VE5 | 9.13 | 9.13 | OPTOCAPE_V0.1 | A+ | A- | A3 | A2 | A1 | A0 | GE5 | 9.24 | 9.26 | 9.26 | 9.14 | 9.16 | 9.18 | 9.27 | 9.14 | 9.16 | 9.18 | 9.27 | 9.41 | 9.41 | VE1 | GE1